# EAGLE design NB-IoT-ideaboard-with-GPS-withnames (EAGLE 8.7.1)

## Sheet 1 of 3
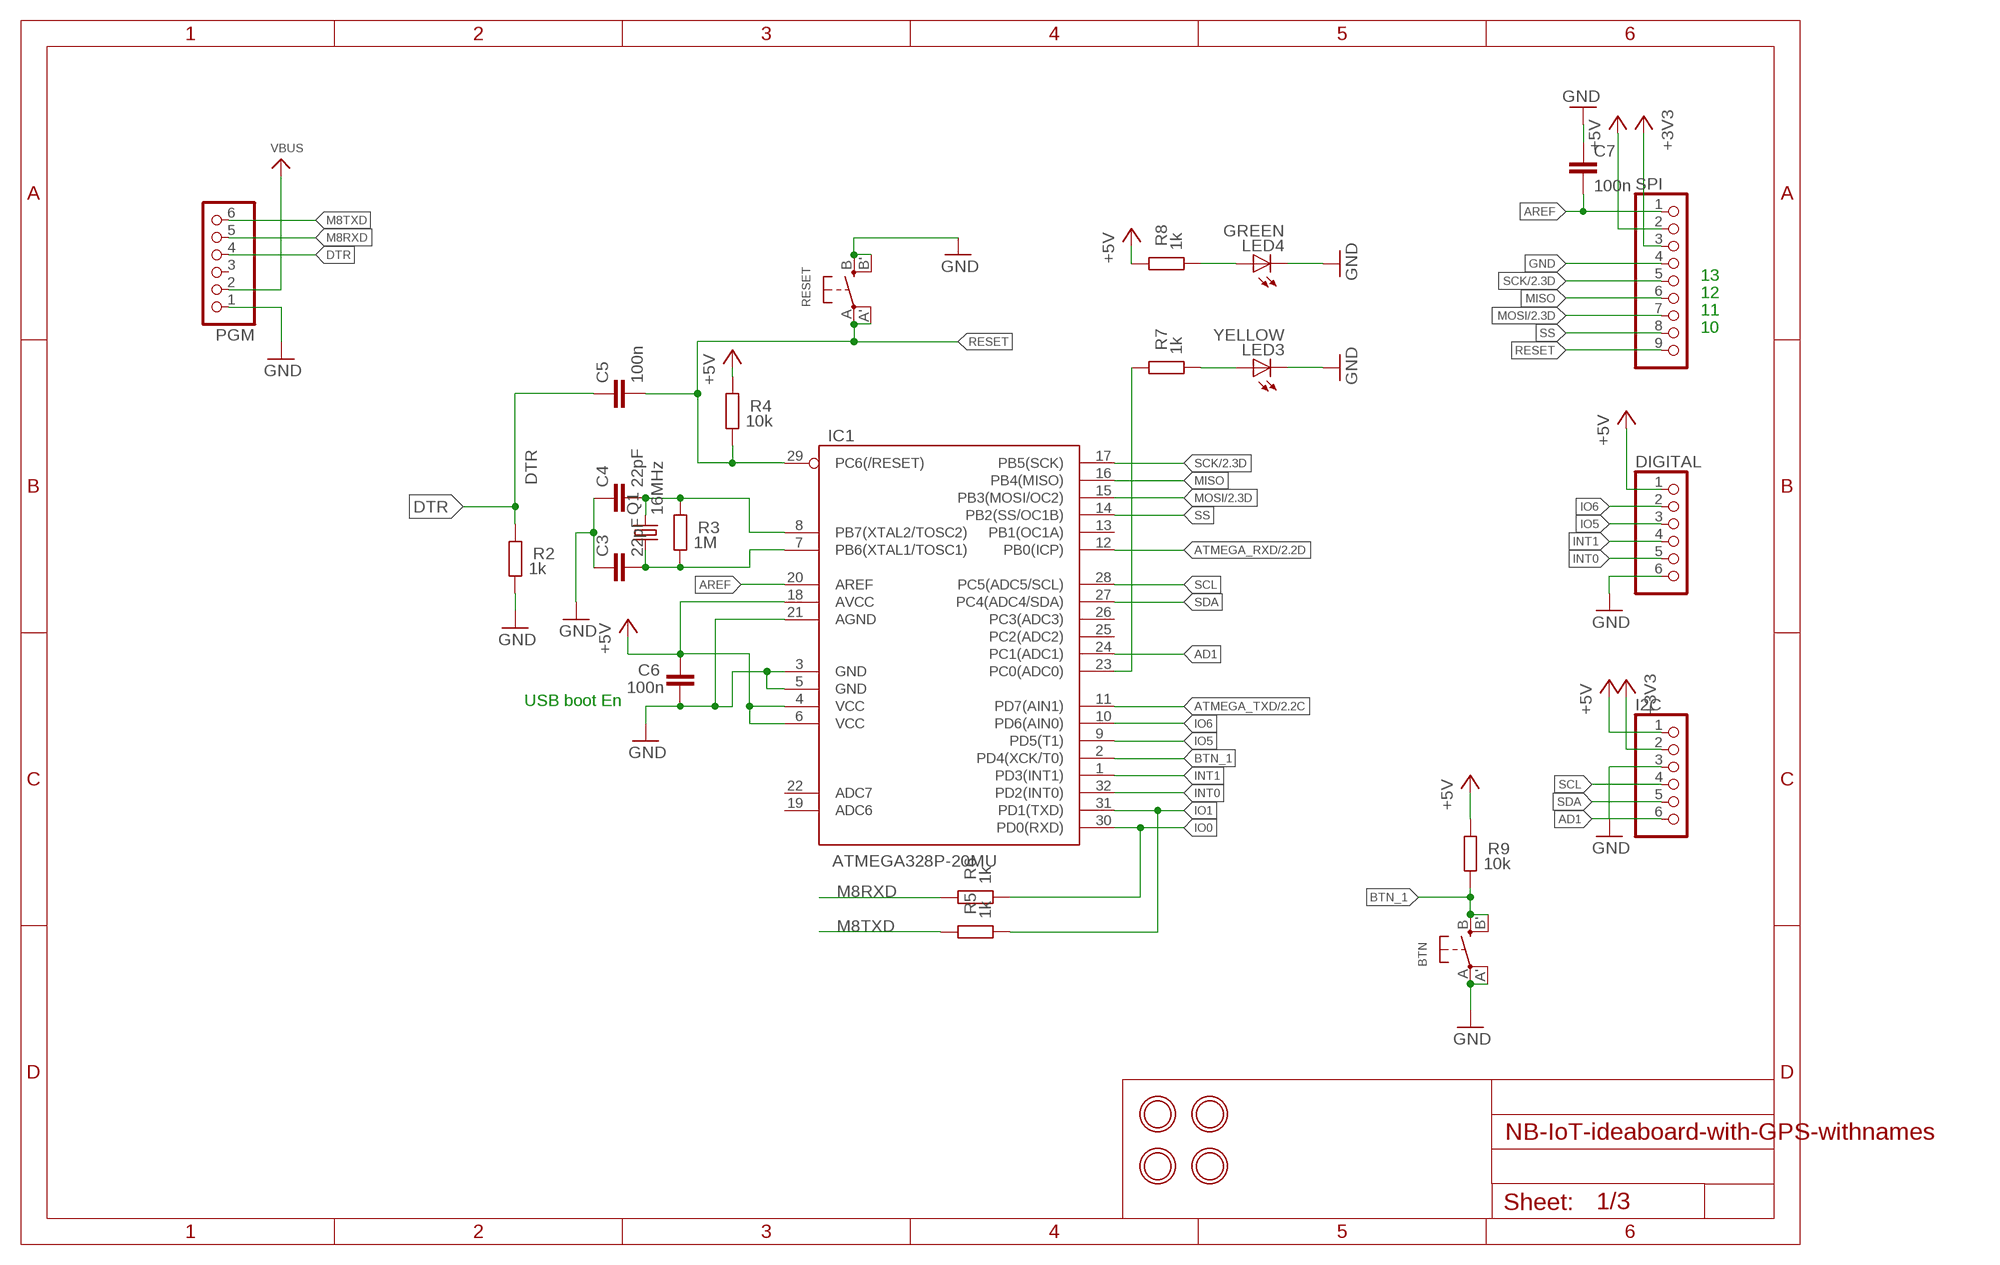
[diagram p0: schematic, sheet 1]

### Parts
$H1  MOUNTINGHOLE3.0THIN  [MOUNTINGHOLE_3.0_PLATEDTHIN]
$H2  MOUNTINGHOLE3.0THIN  [MOUNTINGHOLE_3.0_PLATEDTHIN]
$H3  MOUNTINGHOLE3.0THIN  [MOUNTINGHOLE_3.0_PLATEDTHIN]
$H4  MOUNTINGHOLE3.0THIN  [MOUNTINGHOLE_3.0_PLATEDTHIN]
BTN  SWITCH_TACT_SMT4.6X2.8  [BTN_KMR2_4.6X2.8]
C3  22pF  C-EUC0805  [C0805]
C4  22pF  C-EUC0805  [C0805]
C5  100n  C-EUC0805  [C0805]
C6  100n  C-EUC0805  [C0805]
C7  100n  C-EUC0805  [C0805]
DIGITAL  PINHD-1X6  [1X06]
I2C  PINHD-1X6  [1X06]
IC1  ATMEGA328P-20MU  MEGA8-AI  [TQFP32-08]
LED3  YELLOW  LEDCHIP-LED0805  [CHIP-LED0805]
LED4  GREEN  LEDCHIP-LED0805  [CHIP-LED0805]
PGM  PINHD-1X6  [1X06]
Q1  16MHz  CRYSTALCTS406  [CTS406]
R2  1k  R-EU_R0805  [R0805]
R3  1M  R-EU_R0805  [R0805]
R4  10k  R-EU_R0805  [R0805]
R5  1k  R-EU_R0805  [R0805]
R6  1k  R-EU_R0805  [R0805]
R7  1k  R-EU_R0805  [R0805]
R8  1k  R-EU_R0805  [R0805]
R9  10k  R-EU_R0805  [R0805]
RESET  SWITCH_TACT_SMT4.6X2.8  [BTN_KMR2_4.6X2.8]
SPI  PINHD-1X9  [1X09]

### Nets
+3V3: I2C.2 SPI.3 ; also sheet 3
+5V [usbvcc]: C6.2 DIGITAL.1 I2C.1 IC1.4(VCC) IC1.6(VCC) IC1.18(AVCC) R4.2 R8.2 R9.2 SPI.2 ; also sheet 2,3
AD1: I2C.6 IC1.24(PC1(ADC1))
AREF [aref]: C7.2 IC1.20(AREF) SPI.1
ATMEGA_RXD: IC1.12(PB0(ICP)) ; also sheet 2
ATMEGA_TXD: IC1.11(PD7(AIN1)) ; also sheet 2
BTN_1: BTN.B'(S1) BTN.B(S) IC1.2(PD4(XCK/T0)) R9.1
DTR: C5.1 PGM.4 R2.2
GND [gnd]: BTN.A'(P1) BTN.A(P) C3.1 C4.1 C6.1 C7.1 DIGITAL.6 I2C.3 IC1.3(GND) IC1.5(GND) IC1.21(AGND) LED3.C LED4.C PGM.1 R2.1 RESET.B'(S1) RESET.B(S) SPI.4 ; also sheet 2,3
INT0: DIGITAL.5 IC1.32(PD2(INT0))
INT1: DIGITAL.4 IC1.1(PD3(INT1))
IO0: IC1.30(PD0(RXD)) R6.1
IO1: IC1.31(PD1(TXD)) R5.1
IO5: DIGITAL.3 IC1.9(PD5(T1))
IO6: DIGITAL.2 IC1.10(PD6(AIN0))
M8RXD: PGM.5 R6.2
M8TXD: PGM.6 R5.2
MISO: IC1.16(PB4(MISO)) SPI.6
MOSI: IC1.15(PB3(MOSI/OC2)) SPI.7 ; also sheet 2
N$1: LED3.A R7.1
N$3: LED4.A R8.1
N$23: IC1.23(PC0(ADC0)) R7.2
RESET: C5.2 IC1.29(PC6(/RESET)) R4.1 RESET.A'(P1) RESET.A(P) SPI.9
SCK: IC1.17(PB5(SCK)) SPI.5 ; also sheet 2
SCL: I2C.4 IC1.28(PC5(ADC5/SCL))
SDA: I2C.5 IC1.27(PC4(ADC4/SDA))
SS: IC1.14(PB2(SS/OC1B)) SPI.8
VBUS [usbvcc]: PGM.2 ; also sheet 2,3
XTAL1: C3.2 IC1.7(PB6(XTAL1/TOSC1)) Q1.1 R3.1
XTAL2: C4.2 IC1.8(PB7(XTAL2/TOSC2)) Q1.3 R3.2
Unconnected: IC1.13(PB1(OC1A)) IC1.19(ADC6) IC1.22(ADC7) IC1.25(PC2(ADC2)) IC1.26(PC3(ADC3)) PGM.3

### Notes on the sheet
- 13
- 12
- 11
- 10
- USB boot En

## Sheet 2 of 3
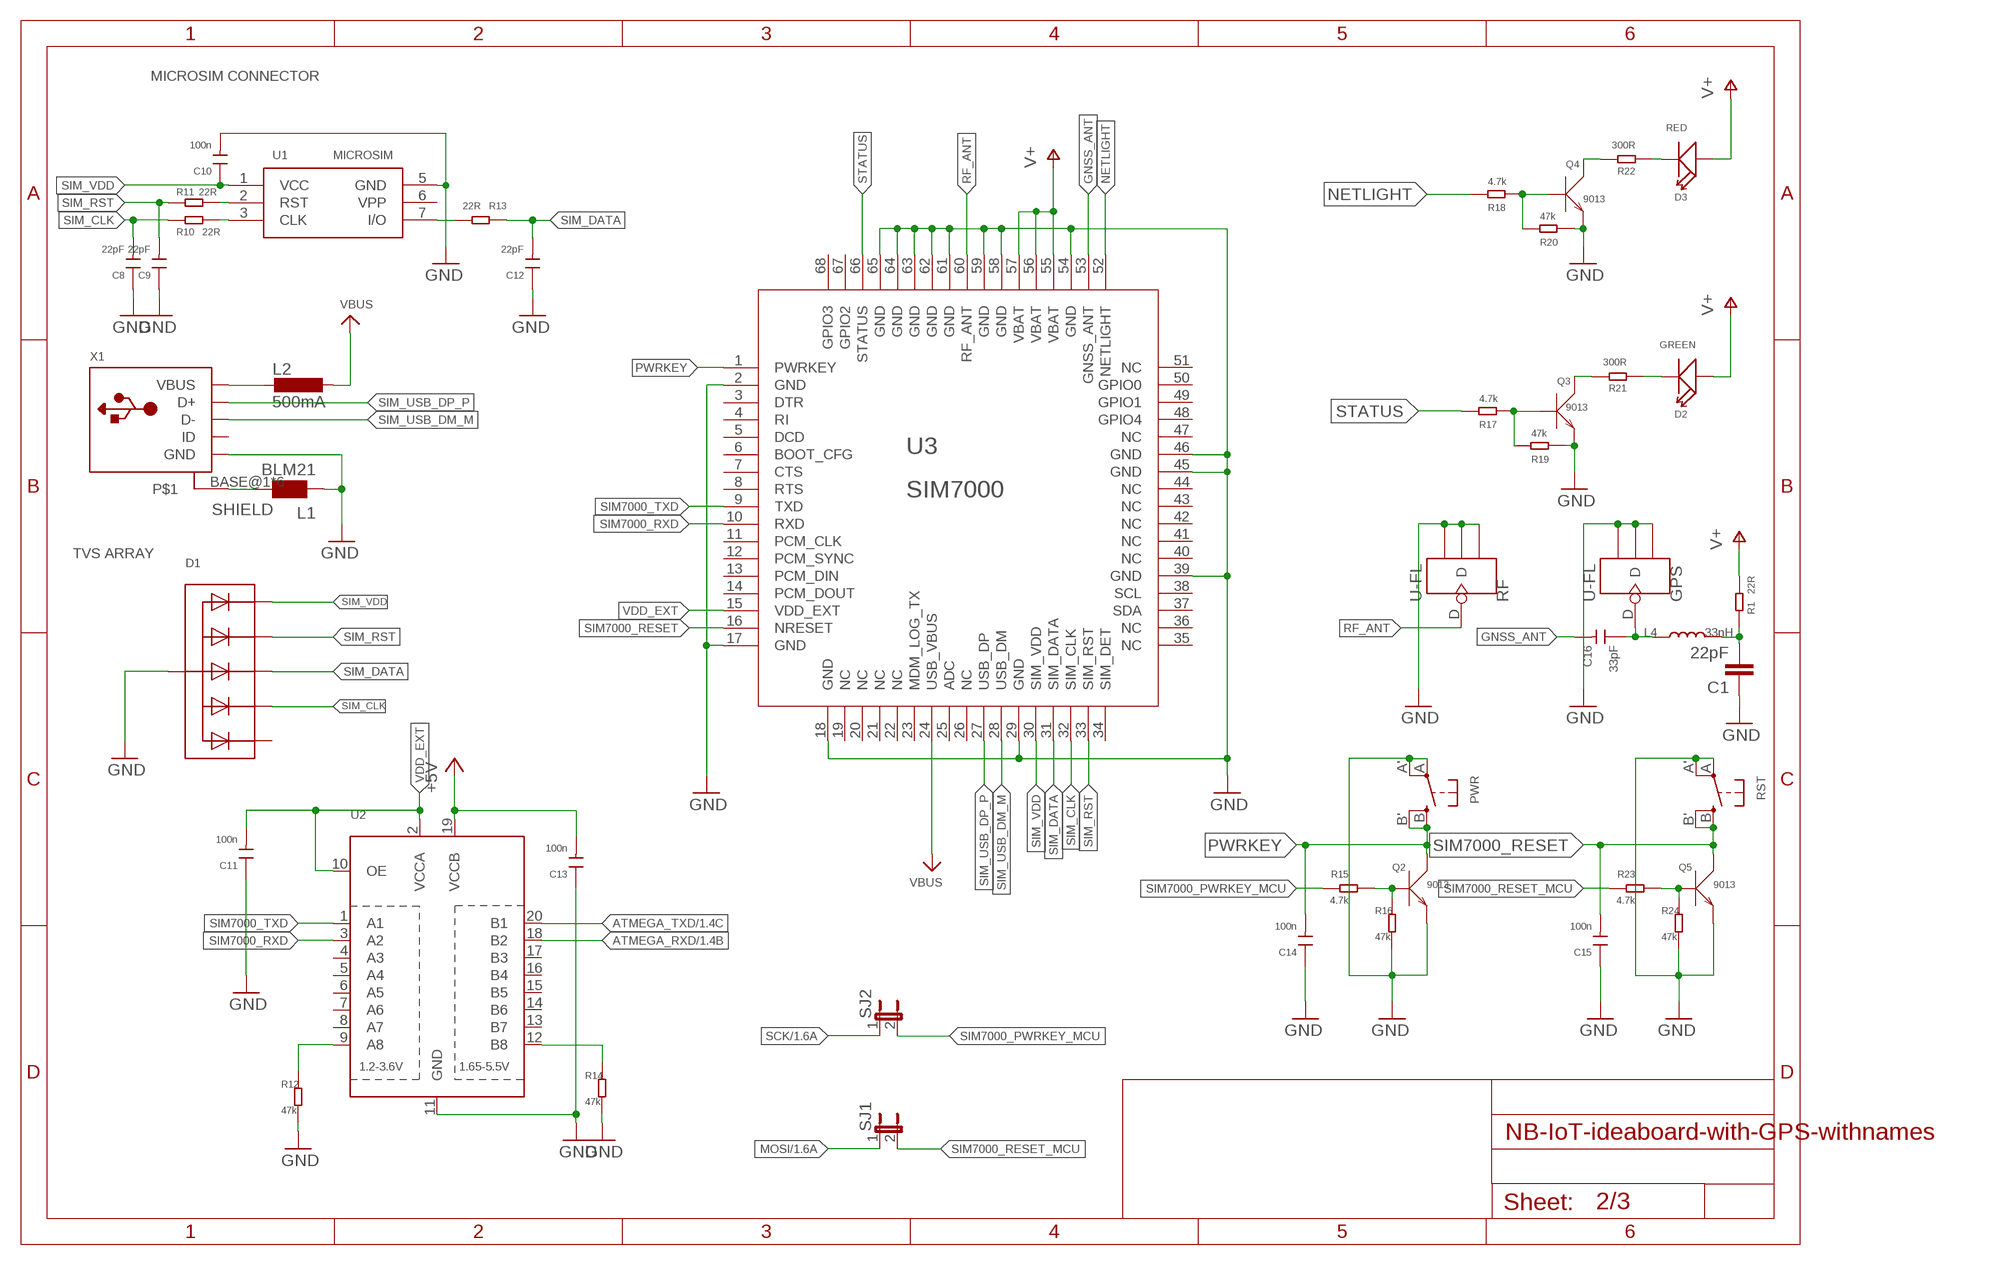
[diagram p1: schematic, sheet 2]

### Parts
C1  22pF  C-EUC0805  [C0805]
C8  22pF  C-0805  [0805]
C9  22pF  C-0805  [0805]
C10  100n  C-0805  [0805]
C11  100n  C-0805  [0805]
C12  22pF  C-0805  [0805]
C13  100n  C-0805  [0805]
C14  100n  C-0805  [0805]
C15  100n  C-0805  [0805]
C16  33pF  C-0805  [0805]
D1  TVSARRAY_5LANE  [SOT363]
D2  GREEN  LED'0805'  [LED-0805]
D3  RED  LED'0805'  [LED-0805]
GPS  U-FL  ANTENNA-U-FL  [4P-U-FL]
L1  BLM21  WE-CBF_0805  [0805]
L2  500mA  L-EUL1812  [L1812]
L4  33nH  L0805  [L0805]
PWR  SWITCH_TACT_SMT4.6X2.8  [BTN_KMR2_4.6X2.8]
Q2  9013  TRANSISTOR-NPN-SOT23  [SOT23]
Q3  9013  TRANSISTOR-NPN-SOT23  [SOT23]
Q4  9013  TRANSISTOR-NPN-SOT23  [SOT23]
Q5  9013  TRANSISTOR-NPN-SOT23  [SOT23]
R1  22R  R-0805  [0805]
R10  22R  R-0805  [0805]
R11  22R  R-0805  [0805]
R12  47k  R-0805  [0805]
R13  22R  R-0805  [0805]
R14  47k  R-0805  [0805]
R15  4.7k  R-0805  [0805]
R16  47k  R-0805  [0805]
R17  4.7k  R-0805  [0805]
R18  4.7k  R-0805  [0805]
R19  47k  R-0805  [0805]
R20  47k  R-0805  [0805]
R21  300R  R-0805  [0805]
R22  300R  R-0805  [0805]
R23  4.7k  R-0805  [0805]
R24  47k  R-0805  [0805]
RF  U-FL  ANTENNA-U-FL  [4P-U-FL]
RST  SWITCH_TACT_SMT4.6X2.8  [BTN_KMR2_4.6X2.8]
SJ1  SPARKFUN-PASSIVES_JUMPER-PTH-2-NC  [SPARKFUN-PASSIVES_PTH-JUMPER-NC_BOTTOM_NO_SILK]
SJ2  SPARKFUN-PASSIVES_JUMPER-PTH-2-NC  [SPARKFUN-PASSIVES_PTH-JUMPER-NC_BOTTOM_NO_SILK]
U1  MICROSIM  [MICROSIM]
U2  TXB0108PWR  [TSSOP20]
U3  SIM7000  [SIM7000]
X1  USB_MICRO_20329_V2  [4UCONN_20329_V2]

### Nets
+5V [usbvcc]: C13.2 U2.19(VCCB) ; also sheet 1,3
ATMEGA_RXD: U2.18(B2) ; also sheet 1
ATMEGA_TXD: U2.20(B1) ; also sheet 1
GND [gnd]: C1.1 C8.1 C9.1 C10.2 C11.1 C12.1 C13.1 C14.1 C15.1 D1.2(A) GPS.GND1 GPS.GND2 GPS.GND3 L1.1 PWR.A'(P1) PWR.A(P) Q2.2(E) Q3.2(E) Q4.2(E) Q5.2(E) R12.2 R14.2 R16.2 R19.2 R20.2 R24.2 RF.GND1 RF.GND2 RF.GND3 RST.A'(P1) RST.A(P) U1.5(GND) U2.11(GND) U3.2(GND) U3.17(GND) U3.18(GND) U3.29(GND) U3.39(GND) U3.45(GND) U3.46(GND) U3.54(GND) U3.58(GND) U3.59(GND) U3.61(GND) U3.62(GND) U3.63(GND) U3.64(GND) U3.65(GND) X1.GND ; also sheet 1,3
GNSS_ANT [ant]: C16.2 U3.53(GNSS_ANT)
MOSI: SJ1.1 ; also sheet 1
N$6: Q3.3(C) R21.2
N$7: D2.- R21.1
N$8: Q3.1(B) R17.2 R19.1
N$10: R13.2 U1.7(I/O)
N$12: R10.1 U1.3(CLK)
N$13: R11.1 U1.2(RST)
N$14: Q5.1(B) R23.2 R24.1
N$15: L2.2 X1.VBUS
N$16: Q4.3(C) R22.2
N$17: D3.- R22.1
N$18: Q4.1(B) R18.2 R20.1
N$19 [ant]: C16.1 GPS.D L4.1
N$20: R12.1 U2.9(A8)
N$21: R14.1 U2.12(B8)
N$29: C1.2 L4.2 R1.2
N$36: Q2.1(B) R15.2 R16.1
NETLIGHT: R18.1 U3.52(NETLIGHT)
PWRKEY: C14.2 PWR.B'(S1) PWR.B(S) Q2.3(C) U3.1(PWRKEY)
RF_ANT [ant]: RF.D U3.60(RF_ANT)
SCK: SJ2.1 ; also sheet 1
SHIELD: L1.2 X1.BASE@1 X1.BASE@2 X1.SPRT@1 X1.SPRT@2 X1.SPRT@3 X1.SPRT@4
SIM7000_PWRKEY_MCU: R15.1 SJ2.2
SIM7000_RESET: C15.2 Q5.3(C) RST.B'(S1) RST.B(S) U3.16(NRESET)
SIM7000_RESET_MCU: R23.1 SJ1.2
SIM7000_RXD: U2.3(A2) U3.10(RXD)
SIM7000_TXD: U2.1(A1) U3.9(TXD)
SIM_CLK: C8.2 D1.5(C4) R10.2 U3.32(SIM_CLK)
SIM_DATA: C12.2 D1.4(C3) R13.1 U3.31(SIM_DATA)
SIM_RST: C9.2 D1.3(C2) R11.2 U3.33(SIM_RST)
SIM_USB_DM_M: U3.28(USB_DM) X1.D-
SIM_USB_DP_P: U3.27(USB_DP) X1.D+
SIM_VDD: C10.1 D1.1(C1) U1.1(VCC) U3.30(SIM_VDD)
STATUS: R17.1 U3.66(STATUS)
V+: D2.+ D3.+ R1.1 U3.55(VBAT) U3.56(VBAT) U3.57(VBAT) ; also sheet 3
VBUS [usbvcc]: L2.1 U3.24(USB_VBUS) ; also sheet 1,3
VDD_EXT: C11.2 U2.2(VCCA) U2.10(OE) U3.15(VDD_EXT)
Unconnected: D1.6(C5) U1.6(VPP) U2.4(A3) U2.5(A4) U2.6(A5) U2.7(A6) U2.8(A7) U2.13(B7) U2.14(B6) U2.15(B5) U2.16(B4) U2.17(B3) U3.3(DTR) U3.4(RI) U3.5(DCD) U3.6(BOOT_CFG) U3.7(CTS) U3.8(RTS) U3.11(PCM_CLK) U3.12(PCM_SYNC) U3.13(PCM_DIN) U3.14(PCM_DOUT) U3.19(NC) U3.20(NC) U3.21(NC) U3.22(NC) U3.23(MDM_LOG_TX) U3.25(ADC) U3.26(NC) U3.34(SIM_DET) U3.35(NC) U3.36(NC) U3.37(SDA) U3.38(SCL) U3.40(NC) U3.41(NC) U3.42(NC) U3.43(NC) U3.44(NC) U3.47(NC) U3.48(GPIO4) U3.49(GPIO1) U3.50(GPIO0) U3.51(NC) X1.ID

### Notes on the sheet
- MICROSIM CONNECTOR
- TVS ARRAY

## Sheet 3 of 3
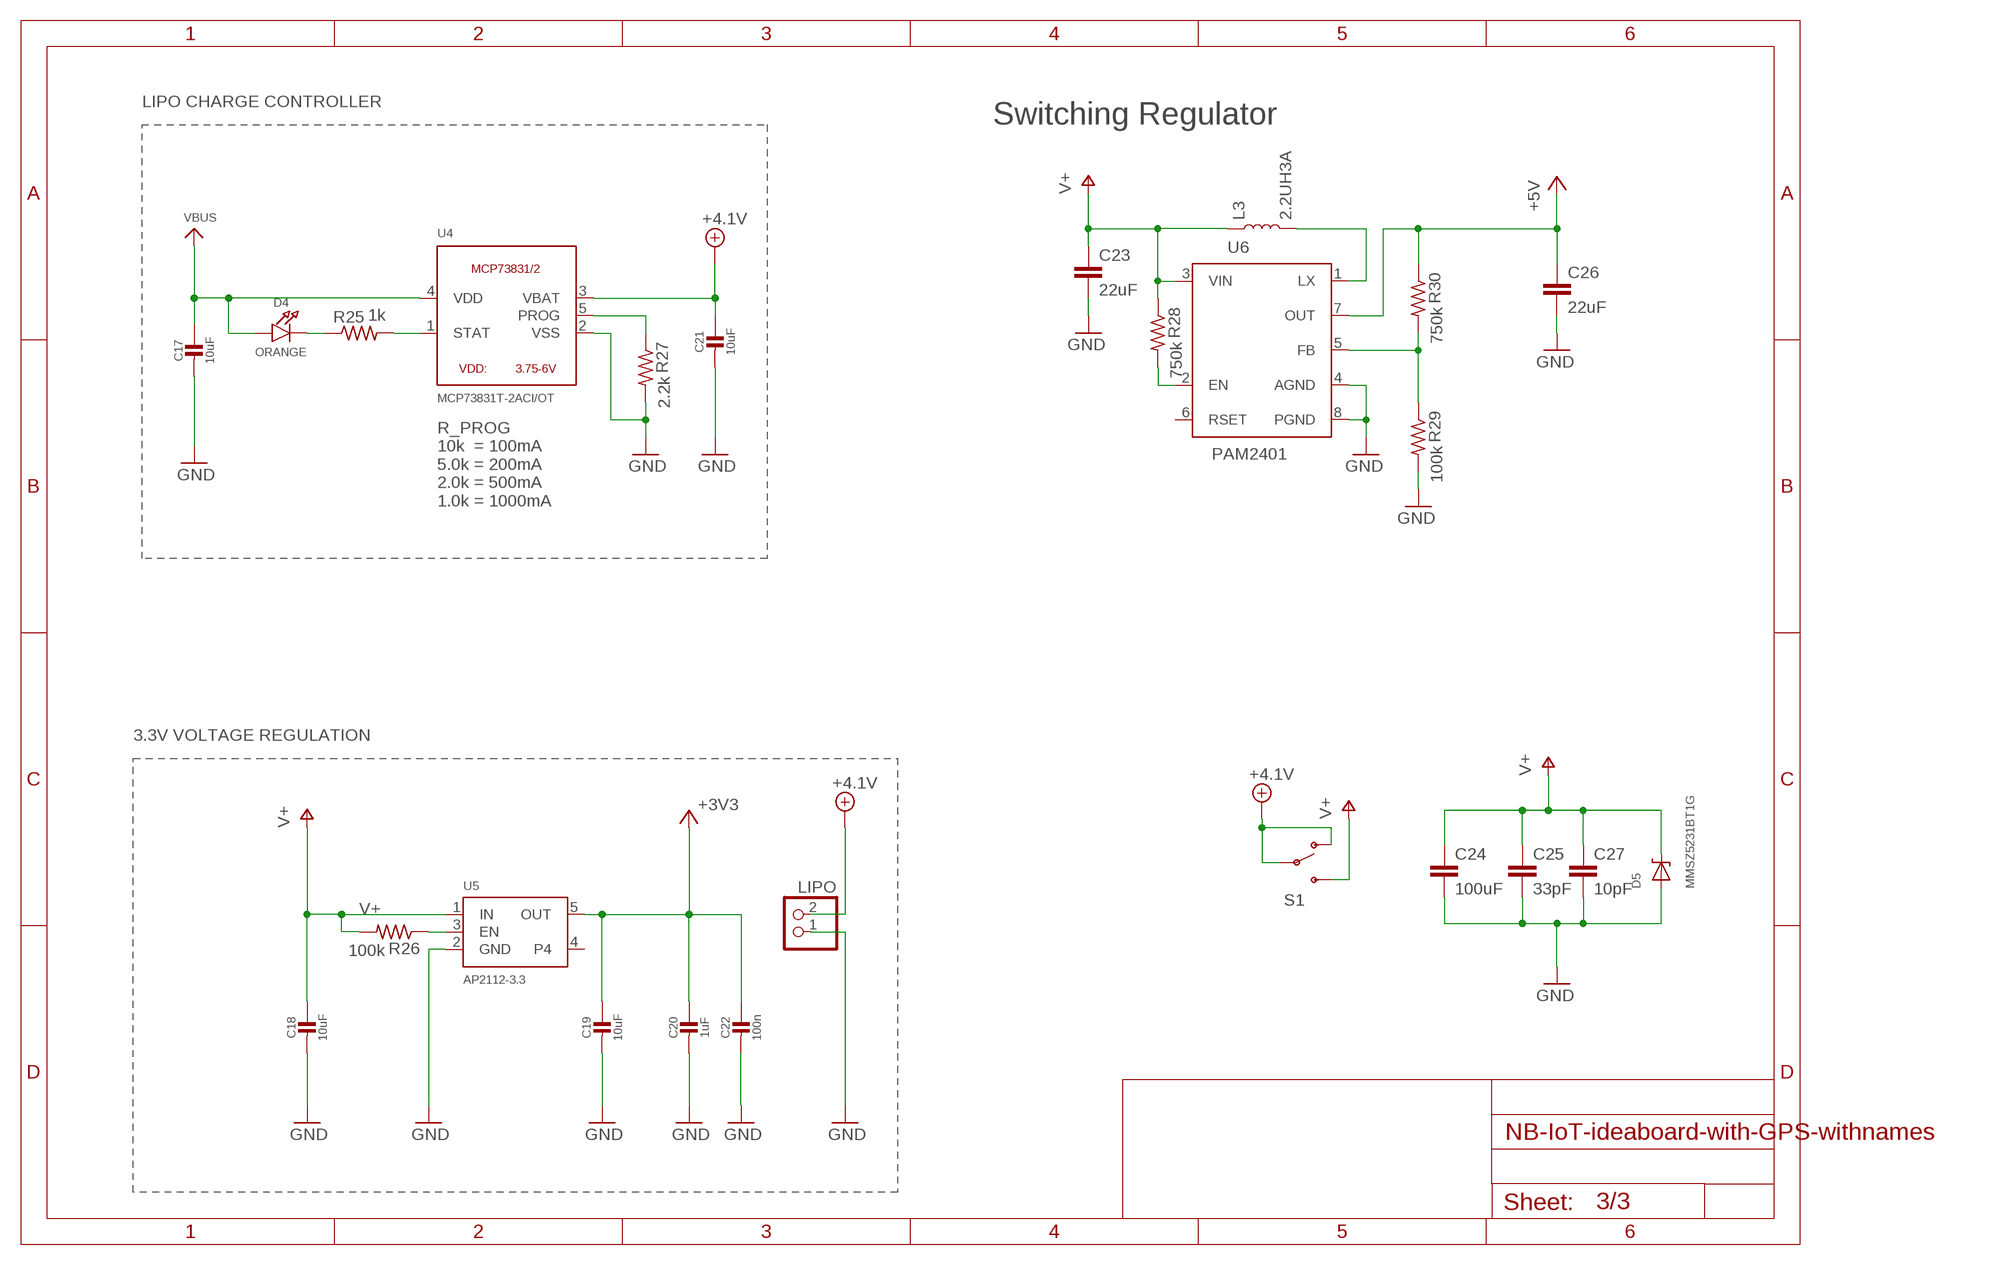
[diagram p2: schematic, sheet 3]

### Parts
C17  10uF  CAP_CERAMIC_0805  [_0805]
C18  10uF  CAP_CERAMIC_0805MP  [_0805MP]
C19  10uF  CAP_CERAMIC_0805MP  [_0805MP]
C20  1uF  CAP_CERAMIC_0805MP  [_0805MP]
C21  10uF  CAP_CERAMIC_0805  [_0805]
C22  100n  CAP_CERAMIC_0805MP  [_0805MP]
C23  22uF  22UF-0805-6.3V-20%  [0805]
C24  100uF  22UF-1210-16V-20%  [1210]
C25  33pF  22UF-0805-6.3V-20%  [0805]
C26  22uF  22UF-0805-6.3V-20%  [0805]
C27  10pF  22UF-0805-6.3V-20%  [0805]
D4  ORANGE  LED0805  [CHIPLED_0805]
D5  MMSZ5231BT1G  DIODE-ZENERSOD123  [SOD-123]
L3  2.2UH3A  INDUCTOR-IFSC1515AHER2R2M01  [INDUCTOR_4X4MM]
LIPO  JST_2PIN-SMT  [JST-PH-2-SMT]
R25  1k  R-US_M0805  [M0805]
R26  100k  R-US_M0805  [M0805]
R27  2.2k  R-US_M0805  [M0805]
R28  750k  R-US_M0805  [M0805]
R29  100k  R-US_M0805  [M0805]
R30  750k  R-US_M0805  [M0805]
S1  SWITCH-SPDT-SMD-A  [SWITCH-SPST-SMD-A]
U4  MCP73831T-2ACI/OT  MCP73831/2  [SOT23-5]
U5  AP2112-3.3  VREG_SOT23-5  [SOT23-5]
U6  PAM2401  [MSOP8]

### Nets
+3V3: C19.1 C20.1 C22.1 U5.5(OUT) ; also sheet 1
+4.1V: C21.1 LIPO.2 S1.1(O) S1.2(P) U4.3(VBAT)
+5V [usbvcc]: C26.1 R30.1 U6.7(OUT) ; also sheet 1,2
EN: R28.2 U6.2(EN)
GND [gnd]: C17.2 C18.2 C19.2 C20.2 C21.2 C22.2 C23.2 C24.2 C25.2 C26.2 C27.2 D5.A LIPO.1 R27.2 R29.2 U4.2(VSS) U5.2(GND) U6.4(AGND) U6.8(PGND) ; also sheet 1,2
N$2: R26.1 U5.3(EN)
N$4: D4.C R25.1
N$5: R25.2 U4.1(STAT)
N$9: R27.1 U4.5(PROG)
N$11: R29.1 R30.2 U6.5(FB)
N$22: L3.P$2 U6.1(LX)
V+: C18.1 C23.1 C24.1 C25.1 C27.1 D5.C L3.P$1 R26.2 R28.1 S1.3(S) U5.1(IN) U6.3(VIN) ; also sheet 2
VBUS [usbvcc]: C17.1 D4.A U4.4(VDD) ; also sheet 1,2
Unconnected: U5.4 U6.6(RSET)

### Notes on the sheet
- LIPO CHARGE CONTROLLER
- Switching Regulator
- R_PROG
  10k  = 100mA
  5.0k = 200mA
  2.0k = 500mA
  1.0k = 1000mA
- 3.3V VOLTAGE REGULATION

## Power pins joined to a net without a drawn wire
GPIO2: U3.67(GPIO2)
GPIO3: U3.68(GPIO3)

## Library data of the parts
$H1-$H4 = Adafruit SIM808 Breakout:MOUNTINGHOLE: Mounting Hole For #2 screws (0.086"/2.18mm width, 0.094"/2.4mm hole) use 2.5mm; BOM: EXCLUDE
BTN PWR RESET RST = Adafruit111:SWITCH_TACT_SMT: SMT Tact Switches 6x6mm - Digikey: P12940SCT-ND KMR2 (4.6x2.8mm) - Digikey: 401-1426-1-ND EVQ-PQHB55 - Light Touch, 160GF (4.5x4.5mm) - Digikey: P8090SCT-ND KMT0 - KMT021 NGJ LHS (etc.) IP68/Waterproof - Digikey: CKN10289CT-ND
C1 C3-C7 = SmartPrj:C-EU: CAPACITOR, European symbol
C8-C16 = Discrete:C*: Ceramic Capacitors
C17-C22 = Adafruit111:CAP_CERAMIC: Ceramic Capacitors For new designs, use the packages preceded by an '_' character since they are more reliable: The following footprints should be used on most boards: _0402 - Standard footprint for regular board layouts _0603 - Standard footprint for regular board layouts _0805 - Standard footprint for regular board layouts _1206 - Standard footprint for regular board layouts For extremely tight-pitch boards where space is at a premium, the following 'micro-pitch' footprints can be used (smaller pads, no silkscreen outline, etc.): _0402MP - Micro-pitch footprint for very dense/compact boards _0603MP - Micro-pitch footprint for very dense/compact boards _0805MP - Micro-pitch footprint for very dense/compact boards _1206MP - Micro-pitch footprint for very dense/compact boards
C23 C26 = SparkFun-Capacitors:22UF: 22µF ceramic capacitors A capacitor is a passive two-terminal electrical component used to store electrical energy temporarily in an electric field.; PROD_ID: CAP-08402
C24 = SparkFun-Capacitors:22UF: 22µF ceramic capacitors A capacitor is a passive two-terminal electrical component used to store electrical energy temporarily in an electric field.
C25 C27 = SparkFun-Capacitors:22UF: 22µF ceramic capacitors A capacitor is a passive two-terminal electrical component used to store electrical energy temporarily in an electric field.; PROD_ID: CAP-08402; VALUE: 22uF
D1 = Adafruit SIM808 Breakout:TVSARRAY_5LANE: Voltage Transient Suppressor Array SOT363 SMF05C - 100W 5V: Digikey - SMF05CT1GOSCT-ND
D2 D3 = Discrete:LED*
D4 = LED-adafruit:LED: LED
D5 = Adafruit SIM808 Breakout:DIODE-ZENER: Zener Diode SMA: 30V 1W Zener Diode, 1.2Vf - Digikey: SMAZ30-FDICT-ND
DIGITAL I2C PGM = pinhead:PINHD-1X6: PIN HEADER
GPS RF = Connector:ANTENNA-U-FL
IC1 = idii:MEGA8: MICROCONTROLLER 8 Kbytes FLASH 1 kbytes SRAM 512 bytes EEPROM USART 6-channel 10 bit ADC 2-channel 8 bit ADC Source: avr.lbr
L1 = wuerth-elektronik:WE-CBF: SMD EMI Suppression Ferrite Beads - excellent anti-EMI properties - low DCR - impedances till 3000 ohms - rated current up to 6 A
L2 = rcl:L-EU: INDUCTOR, European symbol
L3 = SparkFun-Coils:INDUCTOR: Inductors Resist changes in electrical current. Basically a coil of wire. SparkFun Products: SparkFun Load Cell Amplifier - HX711 <https://www.sparkfun.com/products/13879> IOIO-OTG - V2.2 <https://www.sparkfun.com/products/13613>; PROD_ID: NDUC-13770
L4 = GPRS+GSM+GPS Shield v1.0:L*
LED3 LED4 = led:LED: LED
LIPO = adafruit:JST_2PIN: JST 2-Pin Connectors of various flavors SMT-RA (S2B-PH-SM4) 4UConnector #17311 SMT (B2B-PH-SM4) THM-RA (S2B-PH) THM (B2B-PH)
Q1 = crystal:CRYSTAL: CRYSTAL; OC_FARNELL: unknown; OC_NEWARK: unknown
Q2-Q5 = Discrete:TRANSISTOR-NPN*: NPN audion
R1 R10-R24 = Discrete:R*
R2-R9 = SmartPrj:R-EU_: RESISTOR, European symbol
R25-R30 = resistor:R-US_: RESISTOR, American symbol
S1 = SparkFun-Electromechanical:SWITCH-SPDT: SPDT Switch Simple slide switch, Spark Fun Electronics SKU : COM-00102 DPDT SMT slide switch, AYZ0202, SWCH-08179; PROD_ID: SWCH-10651
SJ1 SJ2 = ESP8266_Sparkfun:SPARKFUN-PASSIVES_JUMPER-PTH-2-NC
SPI = pinhead:PINHD-1X9: PIN HEADER
U1 = GPRS+GSM+GPS Shield v1.0:MICROSIM
U2 = adafruit:TXB0108PWR: 8-Bit Bi-Directional Level Shifter 1.2V-3.6V (VCCA) to 1.65V-5.5V (VCCB) bi-directional level shifter with auto direction sensing. Max data rate - VCCA 1.8V: 20Mbps (50ns), VCCA 3.3V: 100Mbps (10ns) Digikey: 296-21527-1-ND
U3 = ICs_v54:SIM7000
U4 = MCP73831:MCP73831/2: MCP73831/2 LIPO Charger VDD: 3.75 - 6V Temp -40 - 85°C Programmable Charge Rate: 15-500mA NOTE: STAT is a tri-state logic output on the MCP73831 and an open-drain output on the MCP73832. SOT23-5 with 4.2V output and tri-state logic on STAT = MCP73831T-2ACI/OT
U5 = AP2112 3.3 Reg:VREG_SOT23-5: SOT23-5 Fixed Voltage Regulators Part Current Out V Out V In V Dropout ?JA (°C/W) TJ (°C) Digikey Part No. ADP121 150mA 3.3V 3.4-5.5V 0.09V @ 150mA -- -- ADP121-AUJZ33R7CT-ND ADP121 150mA 3.0V 3.1-5.5V 0.09V @ 150mA -- -- ADP121-AUJZ30R7CT-ND ADP122 300mA 3.3V 3.4-5.5V 0.085V @ 300mA -- -- ADP122AUJZ-3.3-R7CT-ND ADP1712 300mA 3.3V 3.5-5.5V 0.17V @ 300mA -- -- ADP1712AUJZ-3.3-R7TR-ND AP7311 (Low Cost) 150mA 3.3V 3.5-6V 0.15V @ 150mA -- -- AP7311-33WG-7DICT-ND LD39015M18R 150mA 1.8V 1.9V-5.5V 0.08V @ 100mA -- -- 497-6977-1-ND LP2985A-33DBVR 150mA 3.3V 3.3-16V 0.28V @ 150mA 206 150 296-18479-1-ND MCP1824T-3302E/OT 300mA 3.3V 3.5V-6V 0.2V @ 300mA -- -- MCP1824T-3302E/OTCT-ND MIC5205-2.5YM5 TR 150mA 2.5V 2.7-16V 0.165V @ 150mA -- -- 576-1257-2-ND MIC5205-3.0YM5 TR 150mA 3.0V 3.2V-16V 0.165V @ 150mA -- -- 576-1258-2-ND MIC5205-3.3YM5 TR 150mA 3.3V 3.5V-16V 0.165V @ 150mA -- -- 576-1259-2-ND TPS780330220 150mA 3.3V+2.2V 3.6-5.5V 250mV Max -- -- 296-23332-1-ND TDA3663/N1,135 100mA 3.3V 3.5-45V 0.18V @ 50mA -- -- 568-5343-1-ND Max operating temp can be calculated using ?JA, TJ (max junction temperature), and power in watts. Set the "Maximum Ambient Temperature" until it reaches TJ ("Max Junction Temperature"), which is the absolute limit for safe use of the regulator: Heat Sink Temperature Calculator <http://www.daycounter.com/Calculators/Heat-Sink-Temperature-Calculator.phtml> For example, With 12V source into a 3.3V LP2985 and a 30mA load, we are dissipating (12V-3.3V) * 0.03A = 0.261W. With a ?JA of 206 °C/W, a TJ of 150°C, and 261mW we can safely use the chip without a heat sink up to 75°C (=147.1°C Junction Temperature).
U6 = SparkFun-IC-Power:PAM2401: PAM2401 - Boost PMIC Specifications: Up to 1A output current 0.9V to 4.75V Input Range 2.5V to 5.0V Adjustable Output Voltage Datasheet <https://www.diodes.com/assets/Datasheets/PAM2401.pdf> (Diodes inc.); PROD_ID: IC-13769
X1 = Adafruit SIM808 Breakout:USB: USB Connectors USBMINIB - Surface Mount Female Mini-B USB Connector 4UConnector: 06564

## Net classes
1 power: width 0.406 mm, drill 0.356 mm, clearance 0.152 mm
2 gnd: width 0.203 mm, drill 0.356 mm, clearance 0.152 mm
3 usbvcc: width 0.203 mm, drill 0.356 mm, clearance 0.152 mm
4 aref: width 0.203 mm, drill 0.356 mm, clearance 0.152 mm
5 ant: width 0.33 mm, clearance 0.66 mm

## Board
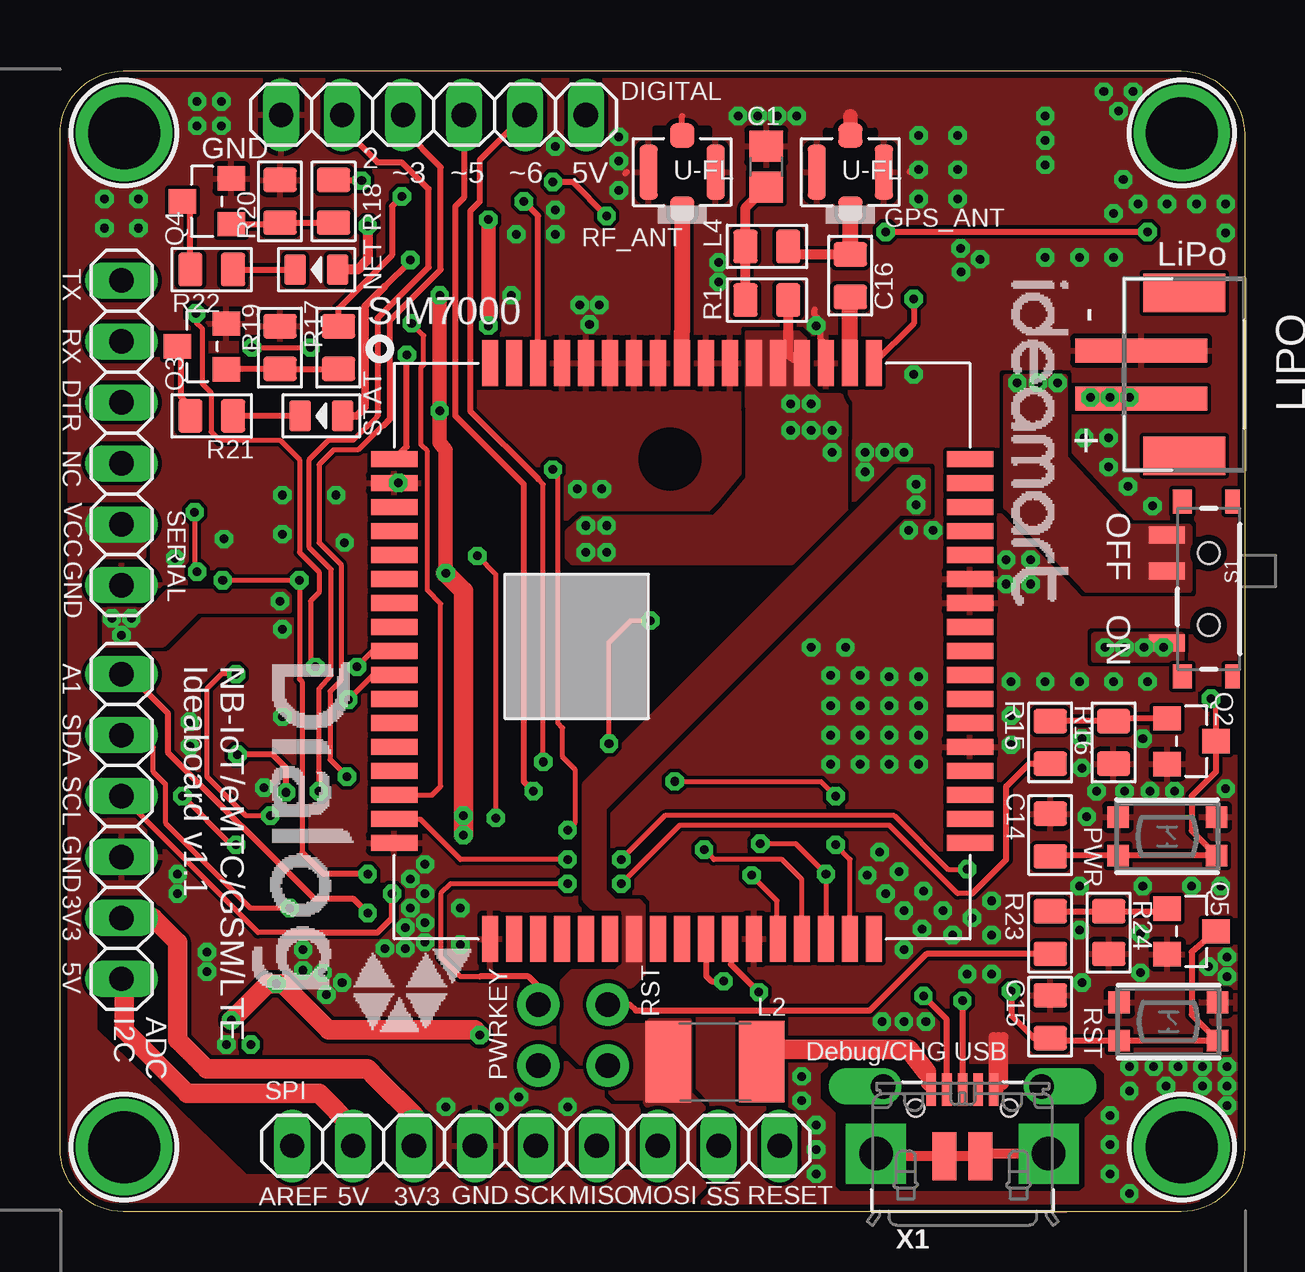
[diagram p3: board, top side]
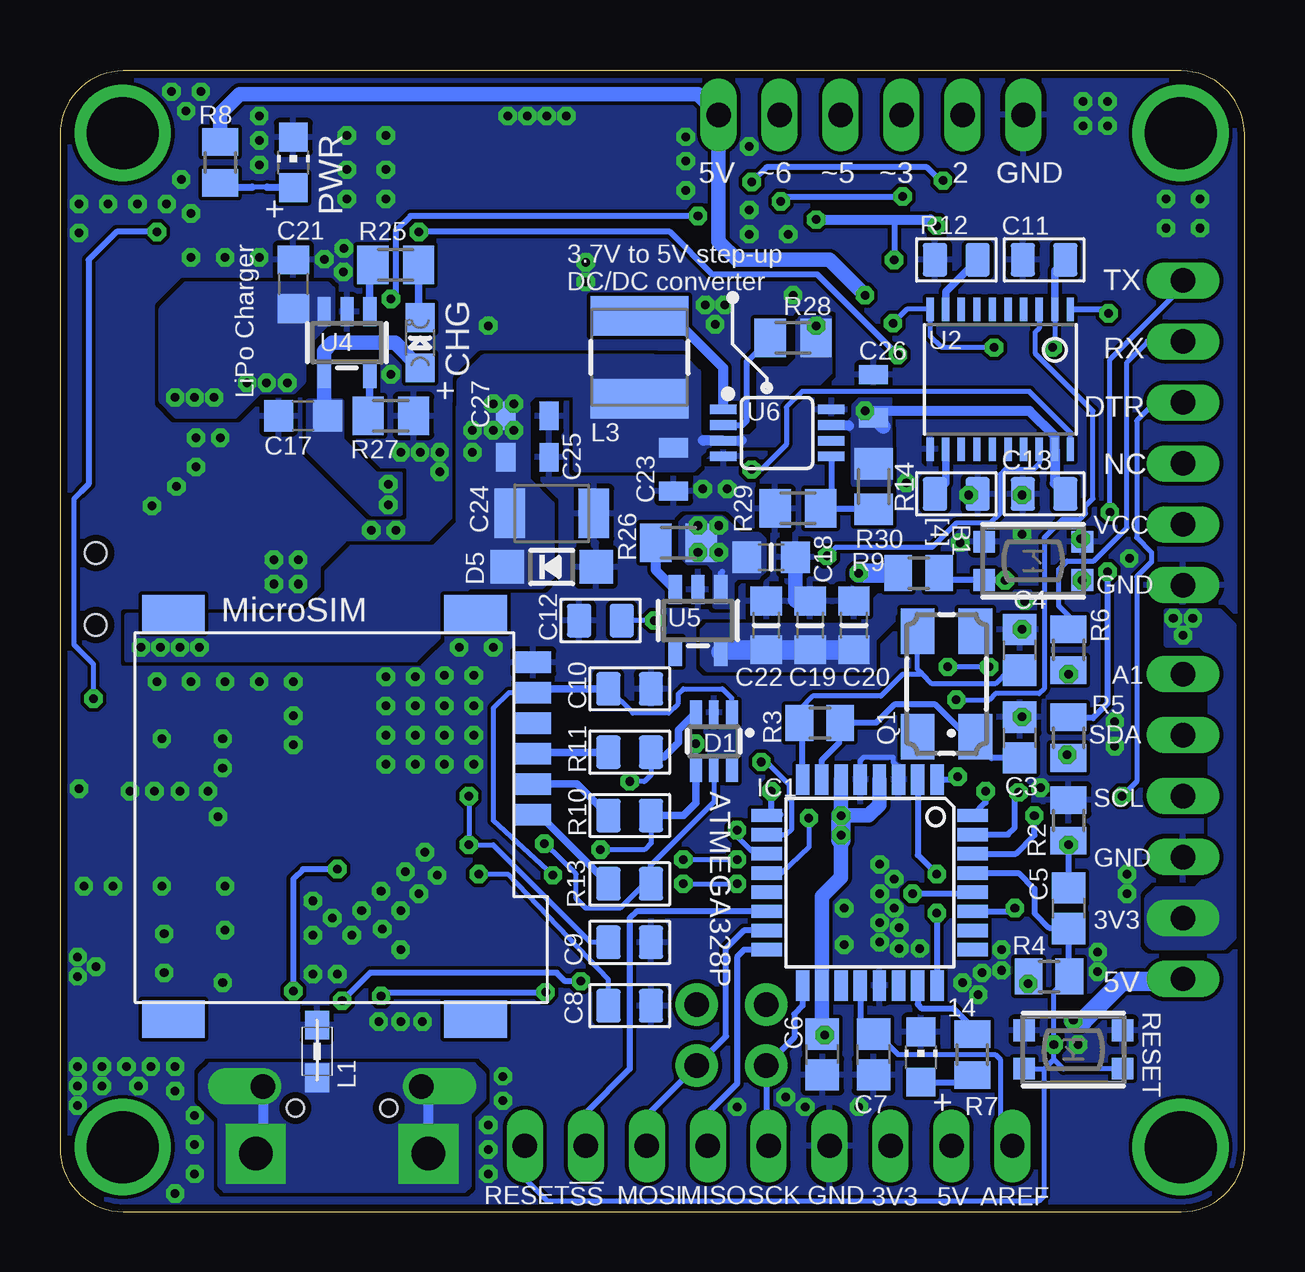
[diagram p4: board, bottom side, seen from below]

Size 49.38 x 47.55 mm. Coordinates in mm from the lower left corner, seen from the top.
Outline: 0,2.64 0,44.91 arc-90 2.64,47.55 46.74,47.55 arc-90 49.38,44.91 49.38,2.64 arc-90 46.74,0 2.64,0 arc-90 0,2.64
Copper layers (1*16): Top 0.035mm / dielectric 1.5mm / Bottom 0.035mm
Design rules "default *": minimum track width 8mil, minimum drill 14mil, track to track 6mil, track to pad 6mil, pad to pad 6mil, via to via 6mil, smd to smd 6mil, copper to edge 12mil, drill to drill 8mil, minimum pad ring 10mil, minimum via ring 8mil, stop-mask expansion 4mil, vias tented up to drill 14mil, thermal gap 8mil

### Footprints (pad centres in the part's own frame; a part is rotated, then mirrored left to right if it is on the bottom)
MOUNTINGHOLE_3.0_PLATEDTHIN = drill 3 pad 3.6: P$1 0,0
BTN_KMR2_4.6X2.8 = smd 0.9 x 0.9: A 2.05,0.8; A' -2.05,0.8; B 2.05,-0.8; B' -2.05,-0.8
C0805 = smd 1.3 x 1.4: 1 -0.85,0; 2 0.85,0
0805 = smd 1.016 x 1.397: 1 -0.889,0; 2 0.889,0
_0805 = smd 1.2 x 1.3: 1 -1.016,0; 2 1.016,0
_0805MP = smd 1.2 x 1.3: 1 -1.016,0; 2 1.016,0
0805' = smd 0.8 x 1.2: 1 -0.9,0; 2 0.9,0
1210 = smd 1.27 x 2.06: 1 -1.755,0; 2 1.755,0
SOT363 = smd 0.5 x 1: 1 -0.75,-1.2; 3 0.75,-1.2; 4 0.75,1.2; 6 -0.75,1.2 | smd 0.4 x 1: 2 0,-1.2; 5 0,1.2
LED-0805 = smd 0.889 x 1.27: + -0.889,0; - 0.889,0
CHIPLED_0805 = smd 1.2 x 1.2: A 0,-1.05; C 0,1.05
SOD-123 = smd 1.4 x 1.4: A 1.85,0; C -1.85,0
1X06 = drill 1.016 long: 1 -6.35,0; 2 -3.81,0; 3 -1.27,0; 4 1.27,0; 5 3.81,0; 6 6.35,0
4P-U-FL = smd 1.016 x 1.016: D -1.524,0; GND3 1.524,0 | smd 2.286 x 0.762: GND1 0,1.397; GND2 0,-1.397
TQFP32-08 = smd 1.27 x 0.559: 1 -4.293,2.8; 2 -4.293,2; 3 -4.293,1.2; 4 -4.293,0.4; 5 -4.293,-0.4; 6 -4.293,-1.2; 7 -4.293,-2; 8 -4.293,-2.8; 17 4.293,-2.8; 18 4.293,-2; 19 4.293,-1.2; 20 4.293,-0.4; 21 4.293,0.4; 22 4.293,1.2; 23 4.293,2; 24 4.293,2.8 | smd 0.559 x 1.27: 9 -2.8,-4.293; 10 -2,-4.293; 11 -1.2,-4.293; 12 -0.4,-4.293; 13 0.4,-4.293; 14 1.2,-4.293; 15 2,-4.293; 16 2.8,-4.293; 25 2.8,4.293; 26 2,4.293; 27 1.2,4.293; 28 0.4,4.293; 29 -0.4,4.293; 30 -1.2,4.293; 31 -2,4.293; 32 -2.8,4.293
0805'' = smd 1.2 x 1: 1 -1.1,0; 2 1.1,0
L1812 = smd 1.9 x 3.4: 1 -1.95,0; 2 1.95,0
INDUCTOR_4X4MM = smd 4.089 x 1.651: P$1 0,1.727; P$2 0,-1.727
L0805 = smd 1.016 x 1.397: 1 -0.889,0; 2 0.889,0
CHIP-LED0805 = smd 1.2 x 1.2: A 0,-1.05; C 0,1.05
JST-PH-2-SMT = smd 1 x 5.5: 1 -1,-1.8; 2 1,-1.8 | smd 1.6 x 3.4: NC1 -3.4,0; NC2 3.4,0
CTS406 = smd 1.9 x 1.4: 1 -2.2,-1.2; 2 2.2,-1.2; 3 2.2,1.2; 4 -2.2,1.2
SOT23 = smd 1.016 x 1.143: 1 -0.95,-1.016; 2 0.95,-1.016; 3 0,1.016
R0805 = smd 1.15 x 1.5: 1 -0.85,0; 2 0.85,0
M0805 = smd 1.3 x 1.6: 1 -0.95,0; 2 0.95,0
SWITCH-SPST-SMD-A = smd 0.7 x 1.5: 1 -2.25,-1.75; 2 -0.75,-1.75; 3 2.25,-1.75 | smd 1 x 0.6: GND1 -3.65,1; GND3 3.65,1 | smd 1 x 0.8: GND2 -3.65,-1.1; GND4 3.65,-1.1 | hole 0.9: -1.5,0; 1.5,0
SPARKFUN-PASSIVES_PTH-JUMPER-NC_BOTTOM_NO_SILK = drill 1.016 pad 1.778: 1 -1.27,0; 2 1.27,0
1X09 = drill 1.016 long: 1 -10.16,0; 2 -7.62,0; 3 -5.08,0; 4 -2.54,0; 5 0,0; 6 2.54,0; 7 5.08,0; 8 7.62,0; 9 10.16,0
MICROSIM = smd 1.5 x 0.9: 1 -0.8,2.5; 2 -0.8,5.04; 3 -0.8,7.58; 5 -0.8,1.23; 6 -0.8,3.77; 7 -0.8,6.31 | smd 2.61 x 1.56: P$1 1.6,-0.8; P$2 14.2,-0.8; P$3 14.2,16.1; P$4 1.6,16.1
TSSOP20 = smd 0.305 x 0.991: 1 -2.925,-2.918; 2 -2.275,-2.918; 3 -1.625,-2.918; 4 -0.975,-2.918; 5 -0.325,-2.918; 6 0.325,-2.918; 7 0.975,-2.918; 8 1.625,-2.918; 9 2.275,-2.918; 10 2.925,-2.918; 11 2.925,2.918; 12 2.275,2.918; 13 1.625,2.918; 14 0.975,2.918; 15 0.325,2.918; 16 -0.325,2.918; 17 -0.975,2.918; 18 -1.625,2.918; 19 -2.275,2.918; 20 -2.925,2.918
SIM7000 = smd 1.93 x 0.66: 1 -12,8; 2 -12,7; 3 -12,6; 4 -12,5; 5 -12,4; 6 -12,3; 7 -12,2; 8 -12,1; 9 -12,0; 10 -12,-1; 11 -12,-2; 12 -12,-3; 13 -12,-4; 14 -12,-5; 15 -12,-6; 16 -12,-7; 17 -12,-8; 35 12,-8; 36 12,-7; 37 12,-6; 38 12,-5; 39 12,-4; 40 12,-3; 41 12,-2; 42 12,-1; 43 12,0; 44 12,1; 45 12,2; 46 12,3; 47 12,4; 48 12,5; 49 12,6; 50 12,7; 51 12,8 | smd 0.66 x 1.93: 18 -8,-12; 19 -7,-12; 20 -6,-12; 21 -5,-12; 22 -4,-12; 23 -3,-12; 24 -2,-12; 25 -1,-12; 26 0,-12; 27 1,-12; 28 2,-12; 29 3,-12; 30 4,-12; 31 5,-12; 32 6,-12; 33 7,-12; 34 8,-12; 52 8,12; 53 7,12; 54 6,12; 55 5,12; 56 4,12; 57 3,12; 58 2,12; 59 1,12; 60 0,12; 61 -1,12; 62 -2,12; 63 -3,12; 64 -4,12; 65 -5,12; 66 -6,12; 67 -7,12; 68 -8,12
SOT23-5 = smd 0.55 x 1.2: 1 -0.95,-1.3; 2 0,-1.3; 3 0.95,-1.3; 4 0.95,1.3; 5 -0.95,1.3
MSOP8 = smd 0.4 x 1.1: 1 -0.975,-2.25; 2 -0.325,-2.25; 3 0.325,-2.25; 4 0.975,-2.25; 5 0.975,2.25; 6 0.325,2.25; 7 -0.325,2.25; 8 -0.975,2.25
4UCONN_20329_V2 = smd 1 x 2: BASE@1 -0.75,-2; BASE@2 0.75,-2 | smd 0.4 x 1.35: D+ 0,0.775; D- -0.65,0.775; GND 1.3,0.775; ID 0.65,0.775; VBUS -1.3,0.775 | drill 1.016 pad 1.454 offset: SPRT@1 -3.3,0.9; SPRT@2 3.3,0.9 | drill 1.397 pad 2.5 square: SPRT@3 -3.6,-1.9; SPRT@4 3.6,-1.9 | hole 0.7: -1.95,0; 1.95,0

### Placement (x,y rotation side)
$H1  46.76,44.96 0 top
$H2  46.76,2.69 0 top
$H3  2.67,44.96 0 top
$H4  2.67,2.69 0 top
BTN  8.81,27.13 0 bottom
C1  29.44,43.56 270 top
C3  9.37,19.76 270 bottom
C4  9.37,23.42 270 bottom
C5  7.34,12.65 270 bottom
C6  17.6,6.55 90 bottom
C7  15.47,6.55 90 bottom
C8  25.63,8.59 180 bottom
C9  25.63,11.23 180 bottom
C10  25.63,21.79 0 bottom
C11  8.36,39.68 0 bottom
C12  26.85,24.64 0 bottom
C13  8.36,29.92 0 bottom
C14  41.27,15.7 270 top
C15  41.27,8.13 270 top
C16  32.94,39.02 270 top
C17  39.24,33.17 180 bottom
C18  19.74,27.28 0 bottom
C19  18.11,24.44 90 bottom
C20  16.28,24.44 90 bottom
C21  39.65,38.66 90 bottom
C22  19.94,24.44 90 bottom
C23  22uF  [0805']  23.8,30.94 270 bottom
C24  28.88,29.11 0 bottom
C25  33pF  [0805']  29.9,31.45 0 bottom
C26  22uF  [0805']  15.47,33.99 90 bottom
C27  10pF  [0805']  29.9,33.17 0 bottom
D1  22.12,19.61 180 bottom
D2  10.9,33.17 180 top
D3  10.69,39.27 180 top
D4  34.37,36.22 0 bottom
D5  28.88,26.87 0 bottom
DIGITAL  15.57,45.72 180 top
GPS  32.94,43.33 90 top
I2C  2.57,16.05 90 top
IC1  15.62,13.72 270 bottom
L1  BLM21  [0805'']  38.66,6.68 270 bottom
L2  27.3,6.25 0 top
L3  25.22,35.61 180 bottom
L4  29.46,40.23 180 top
LED3  13.49,6.45 0 bottom
LED4  39.65,43.74 0 bottom
LIPO  46.86,34.9 270 top
PGM  2.57,32.46 90 top
PWR  46.15,15.65 0 top
Q1  12.42,22 90 bottom
Q2  47.17,19.61 270 top
Q3  5.92,36.07 90 top
Q4  6.12,42.11 90 top
Q5  47.17,11.69 270 top
R1  29.46,38 180 top
R2  7.34,16.31 270 bottom
R3  17.7,20.37 180 bottom
R4  8.15,9.81 180 bottom
R5  7.34,19.76 90 bottom
R6  7.34,23.42 90 bottom
R7  11.35,6.55 90 bottom
R8  42.7,43.74 90 bottom
R9  13.59,26.62 180 bottom
R10  25.63,13.67 0 bottom
R11  25.63,19.15 0 bottom
R12  12.01,39.68 180 bottom
R13  25.63,16.51 180 bottom
R14  12.01,29.92 0 bottom
R15  41.27,19.56 90 top
R16  43.92,19.56 270 top
R17  11.61,36.02 270 top
R18  11.4,42.11 270 top
R19  9.17,36.02 90 top
R20  9.17,42.11 90 top
R21  6.32,33.17 180 top
R22  6.32,39.27 180 top
R23  41.27,11.63 90 top
R24  43.71,11.63 270 top
R25  35.38,39.47 180 bottom
R26  23.6,27.89 0 bottom
R27  35.59,33.17 0 bottom
R28  18.82,36.42 180 bottom
R29  18.62,29.31 180 bottom
R30  15.47,30.23 270 bottom
RESET  7.14,6.76 180 bottom
RF  25.93,43.33 90 top
RST  46.2,7.93 0 top
S1  47.88,25.96 270 top
SJ1  22.83,7.37 90 top
SJ2  19.94,7.37 90 top
SPI  19.84,2.74 0 top
U1  30.45,24.13 180 bottom
U2  10.19,34.7 180 bottom
U3  25.93,23.37 0 top
U4  37.41,36.22 180 bottom
U5  22.78,24.64 180 bottom
U6  19.48,32.46 270 bottom
X1  37.62,4.32 0 top

### Tracks (layer width: path | path; a pad name or v marks a point on that pad's centre or on a via)
+3V3  (via drill 0.36)
  Top 0.813: I2C.2 3.89,12.24 4.9,11.23 4.9,7.16 6.12,5.95 11.58,5.95 12.6,5.95 12.83,5.95 13.25,5.53 14.76,4.01 SPI.3
  Bottom 0.813: C20.1 C19.1 C22.1 21.75,23.42 U5.5
  other vias: 9.17,25.45 2.97,24.74 2.16,24.74 2.57,24.03
  pour Bottom (no thermals): 22.38,24.44 15.87,24.44 15.47,24.03 15.47,22.61 22.38,22.61 22.58,22.81 22.58,24.23
  pour Bottom (no thermals): 15.87,24.23 15.87,25.05 15.06,25.86 8.97,25.86 8.76,25.66 8.76,25.05 14.45,25.05 14.66,24.84 14.66,24.64 15.47,23.83
  pour Bottom (no thermals): 3.28,25.05 3.28,23.62 1.85,23.62 1.45,23.22 1.45,14.07 2.06,13.46 3.68,13.46 4.09,13.06 4.09,11.23 3.89,11.02 0.84,11.02 0.43,11.43 0.43,24.44 1.04,25.05
  pour Top: 9.37,25.86 4.5,25.86 3.89,25.25 1.85,25.25 1.85,23.62 4.29,23.62 5.71,25.05 9.58,25.05 9.58,25.66
+4.1V  (via drill 0.36)
  Top 0.203: v44.58,33.94 45.03,33.94 LIPO.2
  other vias: 39.9,34.55 40.77,34.55 41.58,34.55 42.95,33.94 43.76,33.94
  pour Top (no thermals): 39.45,34.8 41.88,34.8 41.88,31.45 44.58,28.55 47.07,28.55 47.07,25.91 42.82,25.88 42.65,26.06 39.45,29.36
  pour Bottom (no thermals): 39.65,34.19 41.07,34.19 42.09,33.17 44.53,33.17 45.14,33.78 45.14,37.64 44.12,38.66 38.23,38.66 38.02,38.46 38.02,37.24 39.24,36.02 39.24,34.6
+5V  (via drill 0.36)
  Top 0.203: 13.44,7.57 13.44,7.77
  Top 0.61: v15.82,38.2 v15.82,33.38 15.82,32.06 16.08,31.75 v16.08,26.62
  Top 0.813: v16.08,26.62 16.82,25.88 v16.82,16.51 v16.82,15.7 | SPI.2 12.22,3.51 10.79,4.93 5.31,4.93 2.67,7.57 2.67,9.6 I2C.1 | v17.5,7.37 17.3,7.57 13.44,7.57 11.2,7.57 9.27,9.5 v9.02,9.5 8.66,9.5 v7.14,7.98
  Bottom 0.203: 9.02,9.79 R4.2
  Bottom 0.406: U6.7 16.5,32.79 16.48,32.77 | C13.2 7.91,30.36 U2.19 7.91,32.32 8.97,33.38 v15.82,33.38 | v9.02,9.5 9.02,9.79
  Bottom 0.61: v15.82,38.2 17.3,39.68 21.16,39.68 21.92,40.44 DIGITAL.1 22.78,46.59 41.88,46.59 42.7,45.77 R8.2 | C26.1 15.43,33.09 15.06,32.72 | IC1.6 v16.82,16.51 | v16.82,16.51 16.82,13.94 17.62,13.14 IC1.18 17.62,7.89 C6.2 | IC1.4 15.22,16.96 15.67,16.51 v16.82,16.51
  Bottom 0.813: R9.2 v16.08,26.62 | v16.82,16.51 16.82,15.49 | C6.2 17.54,7.4 v17.5,7.37 | I2C.1 2.67,9.6 5.11,9.6 6.73,7.98 v7.14,7.98
  pour Bottom (no thermals): 14.81,33.99 15.87,33.99 16.28,33.58 16.28,33.07 16.48,32.87 16.48,32.67 16.23,32.41 14.81,32.41
  pour Bottom (no thermals): 14.81,32.56 14.81,30.33 16.28,30.33 16.28,32.56
AD1  (via drill 0.36)
  Top 0.254: v12.83,12.45 12.22,13.06 10.59,13.06 4.5,19.15 4.5,20.78 2.87,22.4 I2C.6
  Bottom 0.254: v12.83,12.45 IC1.24
AREF
  Bottom 0.203: C7.2 15.3,7.4 14.45,6.55 10.39,6.55 10.19,6.35 10.19,3.25
  Bottom 0.254: IC1.20 16.02,7.96 C7.2 | 10.19,3.25 SPI.1
ATMEGA_RXD  (via drill 0.36)
  Top 0.203: v17.4,27.33 18.16,26.57 v18.16,16.41
  Bottom 0.203: U2.18 8.56,31.19 8.81,30.94 9.98,30.94 10.19,30.73 10.19,29.11 10.59,28.7 12.01,28.7 13.03,27.69 17.04,27.69 v17.4,27.33 | v18.16,16.41 18.16,15.19 19.29,14.12 IC1.12
ATMEGA_TXD  (via drill 0.36)
  Top 0.203: v21.16,15.9 21.46,16.21 21.46,18.44 20.95,18.95 20.95,20.17 20.75,20.37 20.75,30.73 v20.55,30.94
  Bottom 0.203: U2.20 7.26,32.48 8.97,34.19 18.44,34.19 19.1,33.53 19.1,31.98 20.14,30.94 v20.55,30.94 | v21.16,15.9 21.16,15.65 20.55,15.04 20.03,15.04 IC1.11
BTN_1  (via drill 0.36)
  Top 0.203: 10.59,14.48 10.08,14.99 10.08,22.1 9.98,22.2 v9.98,26.32 v6.78,26.32
  Top 0.254: v12.83,14.07 11,14.07 10.59,14.48 10.13,14.94
  Bottom 0.203: 6.76,26.5 BTN.B 6.83,26.27 v6.78,26.32
  Bottom 0.254: R9.1 12.45,26.33 BTN.B' v9.98,26.33 v9.98,26.32 | IC1.2 13.62,14.87 v12.83,14.07
DTR  (via drill 0.36)
  Top 0.203: v7.34,15.29 7.14,15.29 v5.11,17.32
  Bottom 0.203: 3.53,33.73 3.73,33.73 4.5,32.97 4.5,28.09 3.89,27.48 3.89,27.08 4.5,26.47 4.5,17.93 v5.11,17.32
  Bottom 0.254: C5.1 v7.34,15.29 R2.2 7.3,15.49 | PGM.4 3.53,33.73
EN
  Bottom 0.254: U6.2 20.93,32.79 20.75,32.97 20.75,35.44 R28.2
GND  (via drill 0.36)
  Top 0.203: 38.92,7.29 38.84,7.37
  Top 0.254: U3.54 31.93,36.14 31.7,36.37 31.7,37.12 31.46,37.37 31.46,37.61 | 35.41,43.33 35.56,43.48 | RF.GND3 25.93,45.67 | 23.62,43.33 23.57,43.28 | 31.55,43.46 31.52,43.48
  Top 0.406: RF.GND1 24.54,43.46 | RF.GND2 27.33,43.46 | GPS.GND1 31.55,43.46 | GPS.GND2 34.34,43.46 | X1.GND 38.92,7.29 | 39.12,5.09 39.12,7.29 | 39.32,5.3 39.32,7.29
  Top 0.61: 32.94,45.67 GPS.GND3
  Bottom 0.203: IC1.5 16.02,18.8 15.88,18.95 14.66,18.95 14.66,18.75 14.45,18.54 14.45,18.04 IC1.3
  Bottom 0.61: C18.2 18.72,25.53 18.75,25.5 18.7,25.45 C19.2
  other vias: 14.6,12.65 14.4,10.97 9.27,29.87 11.51,29.87 11.86,27.89 21.56,30.13 22.58,30.13 14.1,30.38 16.69,12.65 16.69,11.13 9.27,24.28 9.27,20.63 5.41,19.41 5.41,20.42 11.1,9.04 11.76,9.55 10.95,9.96 18.31,4.37 21.67,37.8 6.83,28.04 9.27,28.25 4.8,27.23 6.93,6.96 4.9,13.26 6.73,46.28 6.73,45.26 28.27,45.67 29.08,45.67 31.52,1.58 31.52,3.61 34.26,7.93 35.18,7.93 48.39,13.56 48.64,9.81 48.59,17.63 41.07,22.1 42.49,22.1 43.92,22.1 35.79,21.08 35.79,19.86 35.79,18.64 34.16,14.99 34.98,14.17 35.99,13.36 41.07,39.78 42.49,39.78 43.92,39.78 37.41,44.86 37.41,43.44 37.41,42.22 1.85,41 3.28,41 8.51,17.68 16.08,4.37 33.55,31.65 34.37,31.65 35.18,31.65 35.59,34.9 29.9,45.67 30.71,45.67 21.16,4.37 19.13,4.78 4.9,14.07 6.12,10.01 6.12,10.82 10.13,10.92 10.13,10.06 13.54,10.97 14.4,11.84 14.6,13.87 15.21,14.48 15.21,13.26 15.21,12.04 15.21,11.23 34.57,21.08 33.35,21.08 34.57,22.3 32.13,21.08 33.35,22.35 32.74,23.52 31.32,23.52 32.13,22.35 35.79,22.3 34.57,19.86 33.35,19.86 32.13,19.86 34.57,18.64 33.35,18.64 32.13,18.64 39.65,22.1 39.65,20.68 39.65,19.46 45.34,22.1 46.46,17.53 45.44,17.53 44.37,17.53 43.21,17.53 42.6,19.71 42.6,18.49 45.14,19.71 42.8,16.46 47.17,13.56 45.14,13.56 42.49,13.56 48.64,10.62 47.88,10.21 48.64,6.05 48.64,5.23 48.64,4.42 47.62,6.05 47.62,5.23 46.61,6.05 45.59,6.05 44.58,6.05 45.03,9.96 45.03,11.58 42.49,11.74 42.6,9.55 36.8,12.55 38.84,12.96 38.84,11.53 38.02,12.24 38.84,9.91 37.82,9.91 30.91,5.64 30.91,4.62 31.52,2.59 36.09,7.93 1.85,42.22 3.28,42.22 5.71,46.28 5.71,45.26 35.79,44.86 35.79,43.44 35.79,42.22 27.46,38.76 27.46,39.57 37.57,39.17 31.52,36.93 38.35,39.7 37.54,40.16 20.65,44.4 23.29,44.81 23.29,43.79 23.29,42.57 20.65,41.76 20.65,40.74 19.02,40.74 18.82,38.2 33.55,30.84 36.4,28.4 35.38,28.4 39.45,27.18 40.46,27.18 40.46,26.16 39.45,26.16 42.7,32.26 43.71,32.26 43.71,31.04 44.53,30.23 45.54,29.41 35.18,12.55 33.65,14.02 35.18,10.92 35.94,11.79 37.21,11.53 34.42,13.26 44.58,5.03 43.76,4.01 43.76,2.8 43.76,1.58 44.58,0.76 46.1,5.23 47.37,42.01 48.59,42.01 46.15,42.01 44.93,42.01 44.32,43.03 48.59,40.79 43.92,41.61 44.73,46.69 43.51,46.69 44.12,45.87 41.07,45.67 41.07,43.64 41.07,44.65 22.48,37.8 22.07,36.98
  pour Bottom (rank 6): -0.18,50.24 -0.18,-0.15 50.22,-0.15 50.22,50.24
  pour Top (rank 6): -0.18,50.24 -0.18,-0.15 50.22,-0.15 50.22,50.24
GNSS_ANT
  Top 0.66: U3.53 32.93,38.12 C16.2
INT0  (via drill 0.36)
  Top 0.203: 10.79,18.34 10.79,21.79 11.3,22.35 11.3,26.77 10.39,27.69 10.39,31.34 11.2,32.16 12.22,32.16 13.23,33.17
  Top 0.254: 10.79,18.34 v10.79,17.53 | DIGITAL.5 11.76,45.21 13.23,43.74 14.25,43.74 15.37,42.62 15.37,39.37 13.23,37.24 13.23,33.17
  Bottom 0.254: v10.79,17.53 10.79,17.05 IC1.32
INT1  (via drill 0.36)
  Top 0.203: 13.46,32.75 13.42,32.75 12.42,31.75 11.4,31.75 10.79,31.14 10.79,27.89 11.71,26.98 11.71,22.15 11.25,21.69 11.25,18.85 v11.96,18.14
  Top 0.254: 13.74,33.02 13.46,32.75 13.74,33.03 13.74,37.14 15.88,39.27 15.88,43.54 14.3,45.11 DIGITAL.4
  Bottom 0.254: IC1.1 12.14,18.01 v11.96,18.14
IO0  (via drill 0.36)
  Top 0.203: v7.34,22.4 6.73,22.4 6.12,21.79 6.12,18.14 7.75,16.51 v8.76,16.51
  Bottom 0.254: IC1.30 9.54,14.92 8.76,15.7 v8.76,16.51 | R6.1 v7.34,22.4
IO1  (via drill 0.36)
  Top 0.254: v9.42,17.48 9.42,18.49 8.87,19.05 v7.39,19.05
  Bottom 0.254: IC1.31 9.86,15.72 9.58,16 9.58,17.32 v9.42,17.48 | v7.39,19.05 7.38,18.95 R5.1
IO5  (via drill 0.36)
  Top 0.254: DIGITAL.3 16.84,42.27 16.48,41.91 16.48,33.17 19.33,30.33 19.33,17.93 v19.74,17.53
  Bottom 0.254: 19.33,16.54 IC1.9 19.74,16.7 v19.74,17.53
IO6  (via drill 0.36)
  Top 0.203: v20.14,18.75 20.14,30.33 19.94,30.53
  Top 0.254: 19.94,30.53 17.09,33.38 17.09,41.71 17.5,42.11 17.5,43.84 DIGITAL.2
  Bottom 0.203: IC1.10 19.11,15.72 18.87,15.95 18.87,17.12 18.97,17.22 18.97,17.78 19.94,18.75 v20.14,18.75
  Bottom 0.254: 19.32,15.7 IC1.10 19.93,15.7
M8RXD
  Bottom 0.203: 4.04,36.27 4.9,35.41 4.9,28.5 6.27,27.13 7.39,27.13 7.75,26.77 7.75,25.25 7.3,24.8 7.3,24.23
  Bottom 0.254: PGM.5 4.04,36.27 | 7.3,24.23 R6.2
M8TXD  (via drill 0.36)
  Top 0.203: v5.61,29.16 5.61,26.77 v5.71,26.67
  Bottom 0.203: PGM.6 2.56,38.56 5.61,35.51 v5.61,29.16
  Bottom 0.254: v5.71,26.67 5.71,21.18 6.33,20.57 7.3,20.57 R5.2
MISO
  Bottom 0.254: IC1.16 20.86,10.92 21.16,10.62 21.16,5.33 22.38,4.12 SPI.6
MOSI
  Bottom 0.254: SPI.7 24.92,4.01 SJ1.1 21.61,7.32 21.61,10.97 20.87,11.72 IC1.15
N$1
  Bottom 0.254: LED3.A 11.65,5.4 R7.1
N$2
  Bottom 0.406: R26.1 24.55,26.75 U5.3
N$3
  Bottom 0.203: 40.74,42.7 41.38,42.7
  Bottom 0.305: LED4.A 40.74,42.7 | 41.38,42.7 42.5,42.69
  Bottom 0.61: 42.5,42.69 R8.1
N$4
  Bottom 0.305: R25.1 34.43,37.34 D4.C
N$5
  Bottom 0.305: U4.1 36.46,39.34 R25.2
N$6
  Top 0.254: Q3.3 5.03,36.04 5.03,33.98 5.44,33.58 R21.2
N$7
  Top 0.254: D2.- R21.1
N$8
  Top 0.254: Q3.1 7.03,35.13 R19.1 R17.2
N$9
  Bottom 0.305: U4.5 36.46,33.24 R27.1
N$10
  Bottom 0.305: U1.7 27.83,17.82 R13.2
N$11
  Bottom 0.254: U6.5 17.23,29.75 R29.1 15.3,29.31 R30.2
N$12
  Bottom 0.305: U1.3 29.4,16.55 R10.1
N$13
  Bottom 0.254: 29.59,19.15 U1.2
  Bottom 0.305: R11.1 29.59,19.15
N$14
  Top 0.254: Q5.1 46.04,12.52 R24.1 R23.2
N$15
  Top 0.406: 36.11,5.82 36.11,5.3 X1.VBUS
  Top 0.813: 36.11,5.82 35.38,6.76 29.56,6.76 L2.2
N$16
  Top 0.254: R22.2 5.44,41.78 Q4.3
N$17
  Top 0.254: R22.1 D3.-
N$18
  Top 0.254: Q4.1 9.03,41.16 R20.1 R18.2
N$19
  Top 0.406: L4.1 30.68,39.9 C16.1
  Top 0.66: C16.1 GPS.D
N$20
  Bottom 0.305: U2.9 12.46,38.34 R12.1
N$21
  Bottom 0.305: U2.12 12.46,30.36 R14.1
N$22
  Bottom 0.406: U6.1 21.73,35.17 23.95,37.39 25.17,37.39 L3.P$2
N$23
  Bottom 0.254: IC1.23 13.62,8.64 13.46,8.48 12.14,8.48 11.37,7.71 R7.2
N$24
  cutout Top: 24.82,45.16 27.05,45.16 27.05,42.11 24.82,42.11
N$27
  cutout Top: 31.93,45.06 33.96,45.06 33.96,42.11 31.93,42.11
N$28
  cutout Top: 32.54,0.86 42.49,0.86 42.7,1.07 42.7,3.91 43.51,4.73 43.51,5.74 43.1,6.15 32.13,6.15 31.72,5.74 31.72,4.73 32.33,4.12 32.33,1.07
N$29
  Top 0.406: R1.2 L4.2 28.57,41.85 C1.2
N$36
  Top 0.254: Q2.1 44.03,20.56 R16.1 R15.2
NETLIGHT  (via drill 0.36)
  Top 0.254: R18.1 12.55,43 v12.57,42.98 | U3.52 35.59,37.02 v35.59,38.05 | v20.55,42.93 21.36,42.93 v22.78,41.51
  Bottom 0.254: 20.5,42.98 v20.55,42.93 19.94,43.54 13.23,43.54 12.68,42.98 v12.57,42.98 | v35.59,38.05 35.38,38.25 35.38,40.9 34.77,41.51 v22.78,41.51
PWRKEY  (via drill 0.36)
  Top 0.203: 48.18,20.57 48.18,21.18 v47.98,21.39
  Top 0.254: C14.2 41.31,14.85 PWR.B' PWR.B 47.17,15.88 47.17,17.32 48.18,18.34 Q2.3 48.18,20.57 | 14.14,31.57 U3.1 14.45,31.89 v14.45,35.71 | v34.42,40.84 v45.34,40.84
  Bottom 0.203: v47.98,21.39 47.98,22.81 48.79,23.62 48.79,29.72 48.49,30.02
  Bottom 0.254: 48.49,30.02 48.18,30.33 48.18,39.68 47.02,40.84 v45.34,40.84 | v34.42,40.84 23.95,40.84 22.17,39.07 17.8,39.07 v14.45,35.71
RESET  (via drill 0.36)
  Bottom 0.203: RESET.A 8.34,5.96 | 8.34,5.96 7.95,6.35 | 7.95,6.35 v7.95,6.96 7.95,9.16 R4.1 | RESET.A' 7.56,5.96 | 7.56,5.96 7.95,6.35 | SPI.9 30,1.37 29.08,0.46 8.56,0.46 8.36,0.66 8.36,5.95 8.34,5.96 | 7.54,5.95 7.56,5.96
  Bottom 0.254: IC1.29 9.42,14.12 8.76,13.46 8.76,12.45 8.15,11.84 7.38,11.84 C5.2 7.34,9.84 R4.1
RF_ANT
  Top 0.66: U3.60 25.93,36.73 RF.D
SCK
  Bottom 0.203: 19.74,2.64 SPI.5
  Bottom 0.254: IC1.17 18.42,8.58 18.77,8.23 18.77,7.26 SJ2.1 19.94,2.85 SPI.5
SCL  (via drill 0.36)
  Top 0.203: 9.37,11.63 8.26,11.63 I2C.4
  Top 0.254: 9.37,11.63 13.23,11.63 13.84,12.24 v13.84,13.26
  Bottom 0.254: v13.84,13.26 11.39,13.26 IC1.28
SDA  (via drill 0.36)
  Top 0.203: I2C.5 3.38,19.86 3.89,19.36 3.89,18.34 4.39,17.83 4.39,16.21 7.95,12.65 v9.58,12.65
  Bottom 0.254: IC1.27 9.71,12.52 v9.58,12.65
SHIELD
  Top 0.406: X1.SPRT@4 38.47,2.42 X1.BASE@2 X1.BASE@1 34.12,2.32 X1.SPRT@3
  Bottom 0.406: 41.16,5.46 X1.SPRT@2 40.92,2.72 X1.SPRT@4 | X1.SPRT@3 34.02,4.92 X1.SPRT@1
  pour Bottom (no thermals): 32.33,1.07 32.54,0.86 42.49,0.86 42.7,1.07 42.7,3.91 43.51,4.73 43.51,5.74 43.1,6.15 32.13,6.15 31.72,5.74 31.72,4.73 32.33,4.12
SIM7000_PWRKEY_MCU  (via drill 0.36)
  Top 0.203: 38.02,13.26 37.41,13.26 34.57,16.11 25.83,16.11 v23.39,13.67 | 17.5,9.8 16.69,9.8 15.88,10.62 15.88,13.26 16.28,13.67 v21.16,13.67
  Top 0.254: 38.02,13.26 39.45,14.68 39.45,17.73 40.39,18.67 R15.1 | SJ2.2 19.94,9.4 19.53,9.8 17.5,9.8
  Bottom 0.203: v23.39,13.67 v21.16,13.67
SIM7000_RESET  (via drill 0.36)
  Top 0.203: v37.82,14.28 37.01,14.28 34.77,16.51 25.22,16.51 v23.39,14.68 | v21.16,14.68 16.69,14.68 15,16.37 U3.16
  Top 0.254: Q5.3 47.17,10.82 47.17,8.21 RST.B RST.B' 41.39,7.13 C15.2 40.59,7.24 39.65,8.18 v39.65,9.2
  Bottom 0.203: v23.39,14.68 v21.16,14.68
  Bottom 0.254: v37.82,14.28 39.24,14.28 39.65,13.87 v39.65,9.2
SIM7000_RESET_MCU
  Top 0.254: R23.1 36.12,10.74 33.76,8.38 24,8.38 23.75,8.64 SJ1.2
SIM7000_RXD  (via drill 0.36)
  Top 0.203: U3.10 13.05,22.37 v12.01,21.34
  Bottom 0.203: U2.3 8.56,36.83 | v12.01,21.34 10.64,21.34 10.39,21.59 8.56,21.59 8.36,21.79 8.36,28.09 7.59,28.86 6.88,28.86 6.63,29.11 6.63,29.41 6.33,29.72 6.33,33.38 8.71,35.76 8.71,36.68 8.56,36.83 | 8.56,36.83
SIM7000_TXD  (via drill 0.36, 0.36 pad 0.71)
  Top 0.203: v10.64,22.71 10.44,22.91 10.44,25.45 10.79,25.81 10.79,26.67 9.98,27.48 9.98,31.34 9.17,32.16 6.66,32.16 6.3,32.51 6.3,34.14 5.92,34.52 5.92,36.83 5.66,37.09 v5.66,37.44 | U3.9 13.03,23.37 v12.37,22.71
  Bottom 0.203: v10.64,22.71 v12.37,22.71
  Bottom 0.254: U2.1 5.84,37.62 v5.66,37.44
SIM_CLK  (via drill 0.36)
  Top 0.203: U3.32 v31.93,14.07 30.66,15.34 v29.18,15.34
  Bottom 0.203: C8.2 26.52,9.68 30.71,14.07 v31.93,14.07 | v29.18,15.34 27.86,14.07 27.86,13.06 27.46,12.65 26.04,12.65 25.02,13.67 R10.2 24.77,13.69 24.77,14.43 22.12,17.07 D1.5
SIM_DATA  (via drill 0.36)
  Top 0.203: U3.31 30.91,11.39 30.91,13.87 30.1,14.68 27.25,14.68 v26.85,15.09 | v22.89,19.51 22.89,23.73 23.8,24.64 v24.61,24.64
  Bottom 0.203: R13.1 24.74,15.37 25.02,15.09 v26.85,15.09 | D1.4 22.87,19.5 v22.89,19.51 | v24.61,24.64 C12.2
  Bottom 0.305: D1.4 22.87,17.03 23.39,16.51 R13.1
SIM_RST  (via drill 0.36)
  Top 0.203: 32.94,11.38 U3.33 32.93,14.69 v32.33,15.29 | v25.63,17.93 31.73,17.93 v32.33,17.32
  Bottom 0.203: C9.2 27.25,11.23 31.32,15.29 v32.33,15.29 v32.33,17.32 | R11.2 24.74,18.21 25.02,17.93 v25.63,17.93
  Bottom 0.305: R11.2 24.21,18.95 23.6,19.56 23.6,20.09 D1.3
SIM_USB_DM_M  (via drill 0.36)
  Top 0.254: X1.D- 36.97,8.02 v35.99,8.99 | U3.28 27.96,11.34 27.96,10.31 v29.13,9.14
  Bottom 0.254: v35.99,8.99 35.84,9.14 v29.13,9.14
SIM_USB_DP_P  (via drill 0.36)
  Top 0.254: U3.27 26.93,9.82 27.15,9.6 v27.66,9.6 | v37.62,8.79 X1.D+
  Bottom 0.254: v37.62,8.79 36.45,9.96 28.68,9.96 28.32,9.6 v27.66,9.6
SIM_VDD  (via drill 0.36)
  Top 0.203: U3.30 29.9,11.41 29.9,12.96 v28.83,14.02
  Bottom 0.203: U1.1 30.67,21.63 31.32,20.98 31.32,16.31 v28.83,14.02 | D1.1 21.37,21.4 21.77,21.79 23.39,21.79 23.6,21.59 23.6,21.18 24,20.78 25.5,20.78 C10.1
  Bottom 0.305: C10.1 29.49,21.79 U1.1
SS
  Bottom 0.254: IC1.14 25.36,12.52 25.63,12.24 25.63,5.95 27.46,4.12 SPI.8
STATUS  (via drill 0.36)
  Top 0.254: U3.66 19.93,41.51 v19.33,42.11 | R17.1 11.61,37.64 13.84,39.88 13.84,41.91 v14.25,42.32
  Bottom 0.254: v19.33,42.11 19.13,42.32 v14.25,42.32
V+  (via drill 0.36)
  Top 0.254: v14.61,39.68 14.61,39.63 13.53,38.56
  Top 0.305: D2.+ 12.37,33.17 12.72,33.53 12.72,37.75 13.53,38.56 13.44,38.46
  Top 0.406: v12.83,41.1 12.83,39.68 12.42,39.27 D3.+ | R1.1 30.35,35.75 U3.55
  Top 0.61: v17.86,36.93 v17.86,41.35
  Bottom 0.254: U5.1 21.83,26.61 21.77,26.67 | v14.61,39.68 14.61,41.3 13.03,41.3
  Bottom 0.406: 20.95,32.16 20.98,32.14 U6.3 22.56,32.14 22.58,32.16 | v17.86,41.35 13.08,41.35 13.03,41.3 v12.83,41.1
  other vias: 46,23.52 45.19,23.52 30.45,33.68 31.32,33.68 32.18,31.65 32.18,32.56 31.32,32.56 30.45,32.56 21.92,28.6 22.78,28.6 22.78,27.48 21.92,27.48 44.37,23.52 43.56,23.52
  pour Bottom (no thermals): 17.3,35 17.3,37.24 18.47,37.24 18.62,37.09 18.62,35.51 19.02,35.1 20.04,35.1 20.24,34.9 20.24,32.61 20.6,32.26 21.06,32.26 21.06,32.01 19.28,32.01 18.92,32.36 18.92,33.38
  pour Bottom (no thermals): 27.86,35.61 23.39,35.61 22.78,35 22.78,32.41 22.63,32.26 22.33,32.26 22.33,31.9 22.78,31.55 22.78,31.14 22.99,30.94 27.86,30.94
  pour Bottom (no thermals): 21.36,25.25 21.36,26.26 21.16,26.47 20.29,26.47 20.04,26.72 20.04,27.99 20.24,28.2 21.06,28.2 21.77,28.91 23.29,28.91 23.49,28.7 23.49,27.38 23.19,27.08 22.38,27.08 22.07,26.77 22.07,25.25
  pour Bottom (no thermals): 46.56,24.84 39.24,24.84 38.23,25.86 38.23,26.67 37.21,27.69 33.76,27.69 32.74,28.7 32.74,33.58 32.33,33.99 30.3,33.99 29.9,33.58 29.9,30.53 28.88,29.52 28.88,26.47 29.29,26.06 32.33,26.06 33.35,25.25 33.35,24.23 34.57,23.01 46.56,23.01
  pour Top (no thermals): 43.1,24.03 43.1,23.01 46.76,23.01 46.76,24.03
  pour Top (no thermals): 28.68,36.63 30.76,36.63 31.01,36.37 31.01,34.6 31.62,33.99 32.33,33.99 32.74,33.58 32.74,32.36 32.54,32.16 30.1,32.16 28.68,33.58
  pour Bottom (no thermals): 24.61,35.61 31.72,35.61 32.74,34.6 32.74,32.36 32.54,32.16 30.1,32.16 29.9,32.36 29.9,33.78 29.59,34.09 24.56,34.09 24.56,35.56
  pour Top (no thermals): 32.54,33.99 29.08,33.99 28.68,33.38 28.68,30.53 27.66,29.31 27.25,28.91 21.77,28.91 21.16,28.35 21.16,27.28 21.36,27.08 30.51,27.08 32.74,29.31 32.74,33.58
VBUS  (via drill 0.36)
  Bottom 0.61: D4.A 35.42,36.22 38.02,36.22 38.36,35.88 U4.4 38.36,33.44 C17.1
  other vias: 35.69,30.33 35.69,29.47
  pour Top (no thermals): 23.39,12.45 24.31,12.45 24.31,9.91 23.8,9.4 22.17,9.4 21.77,8.99 21.77,8.18 22.17,7.77 26.24,7.77 26.24,4.73 23.19,4.73 20.95,6.96 20.95,9.6 21.36,10.01 23.19,10.01 23.39,10.21
  pour Bottom (no thermals): 37.62,33.78 39.04,33.78 39.04,31.75 36.4,29.11 35.18,29.11 35.18,30.74 36.19,30.74 37.62,32.16
  pour Top (no thermals): 23.6,11.02 23.6,12.45 23.39,12.65 22.22,12.65 21.87,13.01 21.87,17.83 34.98,30.94 36.19,30.94 36.19,29.11 34.98,29.11 22.68,16.82 22.68,13.36 23.09,12.96 24.1,12.96 24.31,12.75 24.31,11.13 24.21,11.02
  pour Top (no thermals): 3.48,29.31 3.48,27.28 1.65,27.28 1.45,27.08 1.45,7.57 7.75,1.47 25.22,1.68 25.83,2.29 25.83,3.71 25.22,4.32 24.61,4.32 24.41,4.52 24.41,7.77 24.61,7.98 26.24,7.98 26.24,4.93 26.85,4.32 26.85,1.07 26.24,0.46 0.43,0.46 0.43,29.31
VDD_EXT  (via drill 0.36)
  Top 0.203: v8,36.02 v10.44,36.02 | U3.15 15.51,17.37 15.88,17.73 15.88,25.35 15.32,25.91 15.32,31.7 15.06,31.95 15.06,35.2 15.16,35.31 15.16,36.53 v14.66,37.03
  Bottom 0.203: U2.2 7.91,36.26 v8,36.02 | v10.44,36.02 12.62,36.02 13.11,36.51 U2.10 14.07,37.62 v14.66,37.03
  Bottom 0.305: U2.2 7.91,39.23 C11.2
XTAL1
  Bottom 0.254: C3.2 10.54,18.91 Q1.1 11.54,19.8 12.88,21.13 14.61,21.13 15.37,20.37 R3.1 16.89,20.34 16.89,19.56 17.62,18.83 IC1.7
XTAL2
  Bottom 0.203: 18.52,20.41 18.52,20.98 18.01,21.49 15.16,21.49 14.25,22.4 13.44,22.4 | 9.82,22.57 10.39,22 13.03,22 13.44,22.4 | 13.44,22.4 13.64,22.61 13.64,24.18
  Bottom 0.254: 18.52,20.41 R3.2 18.42,20.24 IC1.8 | C4.2 9.82,22.57 | 13.64,24.18 Q1.3

### Text on the board
tPlace: DIGITAL | GND | 2 | ~3 | ~5 | ~6 | 5V | GPS_ANT | RF_ANT | TX | LiPo | NET | RX | SIM7000 | DTR | NC | STAT | VCC | SERIAL | OFF | GND | ON | A1 | NB-IoT/eMTC/GSM/LTE / Ideaboard v1.1 | SDA | SCL | GND | PWR | 3V3 | 5V | RST | ADC / I2C | RST | Debug/CHG USB | SPI | PWRKEY | AREF | 5V | 3V3 | GND | SCK | MISO | MOSI | !SS | RESET
bPlace: PWR | GND | 2 | ~3 | ~5 | ~6 | 5V | + | LiPo Charger | TX | 3.7V to 5V step-up / DC/DC converter | CHG | RX | + | DTR | NC | B1 | [4] | VCC | GND | MicroSIM | A1 | SDA | ATMEGA328P | SCL | GND | 3V3 | 5V | RESET | 14 | + | AREF | 5V | 3V3 | GND | SCK | MISO | MOSI | !SS | RESET